# EasyEDA Pro project AM-02驱动板.eprj

# Schematic Schematic1
Create Date: 2023-12-01; Page Name: P1; Project Name: AM-02驱动板; Schematic Name: Schematic1; Update Date: 2023-12-22; Company: 嘉立创EDA; Page Size: A4; Version: V1.0
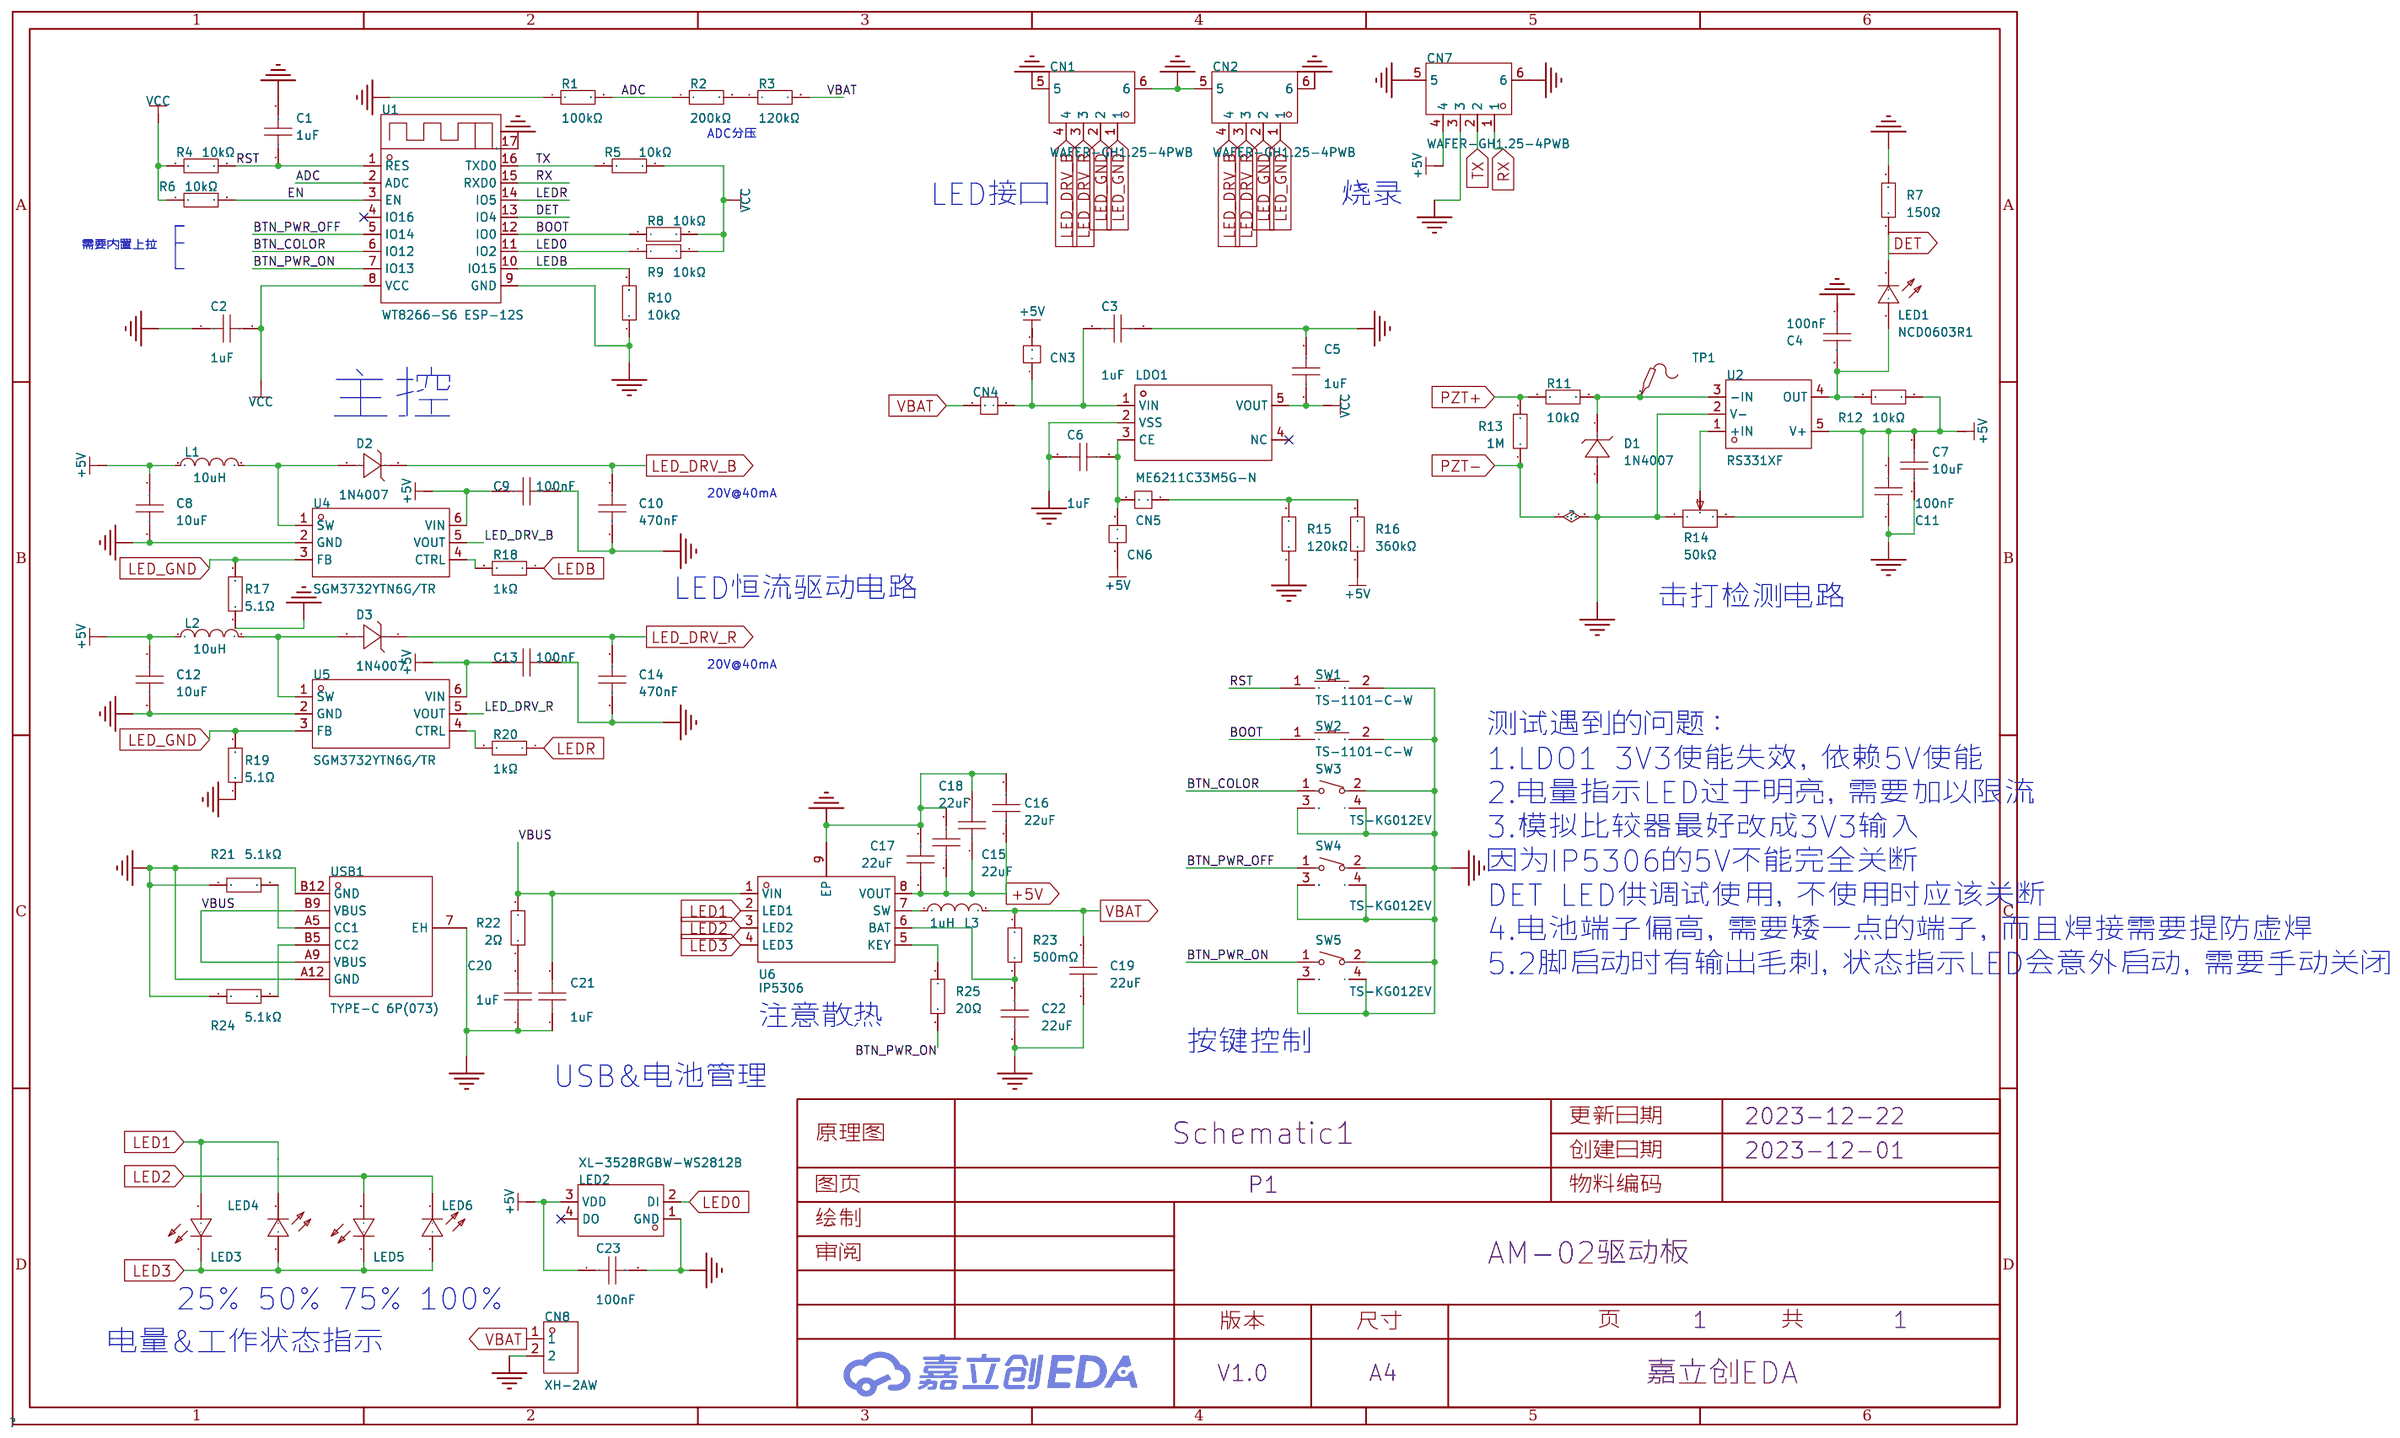
[diagram p0: schematic sheet]

## Parts
C1  1uF  [C0603]
C2  1uF  [C0603]
C3  1uF  [C0603]
C4  100nF  [C0603]
C5  1uF  [C0603]
C6  1uF  [C0603]
C7  10uF  [C0603]
C8  10uF  [C0603]
C9  100nF  [C0603]
C10  470nF  [C0603]
C11  100nF  [C0603]
C12  10uF  [C0603]
C13  100nF  [C0603]
C14  470nF  [C0603]
C15  22uF  [C0603]
C16  22uF  [C0603]
C17  22uF  [C0603]
C18  22uF  [C0603]
C19  22uF  [C0603]
C20  1uF  [C0603]
C21  1uF  [C0603]
C22  22uF  [C0603]
C23  100nF  [C0603]
CN1  WAFER-GH1.25-4PWB  [CONN-SMD_4P-P1.25_XUNPU_WAFER-GH1.25-4PWB]
CN2  WAFER-GH1.25-4PWB  [CONN-SMD_4P-P1.25_XUNPU_WAFER-GH1.25-4PWB]
CN3  -  [cs]
CN4  -  [cs]
CN5  -  [cs]
CN6  -  [cs]
CN7  WAFER-GH1.25-4PWB  [CONN-SMD_4P-P1.25_XUNPU_WAFER-GH1.25-4PWB]
CN8  XH-2AW  [CONN-TH_XH-2AW_C2908611]
D1  1N4007  [SOD-123FL_L2.7-W1.8-LS3.8-RD]
D2  1N4007  [SOD-123FL_L2.7-W1.8-LS3.8-RD]
D3  1N4007  [SOD-123FL_L2.7-W1.8-LS3.8-RD]
L1  10uH  [IND-SMD_L7.3-W6.8]
L2  10uH  [IND-SMD_L7.3-W6.8]
L3  1uH  [IND-SMD_L7.2-W6.6_GPSR0730]
LDO1  ME6211C33M5G-N  [SOT-23-5_L3.0-W1.7-P0.95-LS2.8-BL]
LED1  NCD0603R1  [LED0603-RD_RED]
LED2  XL-3528RGBW-WS2812B  [LED-SMD_4P-L3.5-W2.8-BR-1]
LED3  NCD0603W1  [LED0603-RD]
LED4  NCD0603W1  [LED0603-RD]
LED5  NCD0603W1  [LED0603-RD]
LED6  NCD0603W1  [LED0603-RD]
R1  100kΩ  [R0603]
R2  200kΩ  [R0603]
R3  120kΩ  [R0603]
R4  10kΩ  [R0603]
R5  10kΩ  [R0603]
R6  10kΩ  [R0603]
R7  150Ω  [R0603]
R8  10kΩ  [R0603]
R9  10kΩ  [R0603]
R10  10kΩ  [R0603]
R11  10kΩ  [R0603]
R12  10kΩ  [R0603]
R13  1M  [R0603]
R14  50kΩ  [RES-ADJ-SMD_VG039NCH]
R15  120kΩ  [R0603]
R16  360kΩ  [R0603]
R17  5.1Ω  [R0603]
R18  1kΩ  [R0603]
R19  5.1Ω  [R0603]
R20  1kΩ  [R0603]
R21  5.1kΩ  [R0603]
R22  2Ω  [R0603]
R23  500mΩ  [R0603]
R24  5.1kΩ  [R0603]
R25  20Ω  [R0603]
SW1  TS-1101-C-W  [SW-SMD_L6.0-W3.3-LS8.0]
SW2  TS-1101-C-W  [SW-SMD_L6.0-W3.3-LS8.0]
SW3  TS-KG012EV  [SW-SMD_TS-KG012EV]
SW4  TS-KG012EV  [SW-SMD_TS-KG012EV]
SW5  TS-KG012EV  [SW-SMD_TS-KG012EV]
TP1  -  [Test-Point-0.5mm]
U1  WT8266-S6 ESP-12S  [WIFIM-SMD_16P-L24.0-W16.0-P2.00]
U2  RS331XF  [TSOT-23-5_L2.9-W1.6-P0.95-LS2.8-BR]
U4  SGM3732YTN6G/TR  [TSOT-23-6_L2.9-W1.6-P0.95-LS2.8-BR]
U5  SGM3732YTN6G/TR  [TSOT-23-6_L2.9-W1.6-P0.95-LS2.8-BR]
U6  IP5306  [ESOP-8_L4.9-W3.9-P1.27-LS6.0-BL-EP]
USB1  TYPE-C 6P(073)  [TYPE-C-SMD_TYPE-C-6P]

## Library data of the parts
C1-C3 C5 C6 C20 C21 = CL10A105KB8NNNC: 容值:1uF;精度:±10%;额定电压:50V;材质(温度系数):X5R;; LCSC Part Name: 1uF ±10% 50V; Supplier Part: C15849; Manufacturer: SAMSUNG(三星); Supplier Footprint: 0603; JLCPCB Part Class: Basic Part; Datasheet: https://atta.szlcsc.com/upload/public/pdf/source/20160218/1457707763339.pdf; Supplier: LCSC; Tolerance: ±10%; Voltage Rated: 50V; Temperature Coefficient: X5R
C4 C9 C11 C13 C23 = CC0603KRX7R9BB104: 容值:100nF;精度:±10%;额定电压:50V;材质(温度系数):X7R;; LCSC Part Name: 100nF ±10% 50V; Supplier Part: C14663; Manufacturer: YAGEO(国巨); Supplier Footprint: 0603; JLCPCB Part Class: Basic Part; Datasheet: https://atta.szlcsc.com/upload/public/pdf/source/20180910/C282072_33301C7F631E79921B82A8DAC6BCC5B3.pdf; Supplier: LCSC; Tolerance: ±10%; Voltage Rated: 50V; Temperature Coefficient: X7R
C7 C8 C12 = CL10A106MA8NRNC: 容值:10uF;精度:±20%;额定电压:25V;材质(温度系数):X5R;; LCSC Part Name: 10uF ±20% 25V; Supplier Part: C96446; Manufacturer: SAMSUNG(三星); Supplier Footprint: 0603; JLCPCB Part Class: Basic Part; Datasheet: https://atta.szlcsc.com/upload/public/pdf/source/20160218/1457707763339.pdf; Supplier: LCSC; Tolerance: ±20%; Voltage Rated: 25V; Temperature Coefficient: X5R
C10 C14 = 0603B474K500NT: 容值:470nF;精度:±10%;额定电压:50V;材质(温度系数):X7R;; LCSC Part Name: 470nF ±10% 50V; Supplier Part: C77572; Manufacturer: FH(风华); Supplier Footprint: 0603; JLCPCB Part Class: Extended Part; Datasheet: https://atta.szlcsc.com/upload/public/pdf/source/20200305/C486355_26A10D38EF8C2A5C37091D0039909270.pdf; Supplier: LCSC; Tolerance: ±10%; Voltage Rated: 50V; Temperature Coefficient: X7R
C15-C19 C22 = CL10A226MQ8NRNC: 容值:22uF;精度:±20%;额定电压:6.3V;材质(温度系数):X5R;; LCSC Part Name: 22uF ±20% 6.3V; Supplier Part: C59461; Manufacturer: SAMSUNG(三星); Supplier Footprint: 0603; JLCPCB Part Class: Basic Part; Datasheet: https://atta.szlcsc.com/upload/public/pdf/source/20160218/1457707763339.pdf; Supplier: LCSC; Tolerance: ±20%; Voltage Rated: 6.3V; Temperature Coefficient: X5R
CN1 CN2 CN7 = WAFER-GH1.25-4PWB: 参考系列:GH;间距:1.25mm;插针结构:1x4P;排数:1;每排PIN数:4;公母:公型插针;安装方式:卧贴;额定电流:1A;工作温度范围:-25℃~+85℃;; LCSC Part Name: GH1.25mm 4P 卧贴带扣 带扣; Supplier Part: C3029379; Manufacturer: XUNPU(讯普); Supplier Footprint: SMD,P=1.25mm; JLCPCB Part Class: 扩展库; Datasheet: https://atta.szlcsc.com/upload/public/pdf/source/20220527/CB8773BFB0913C3B8ABD62CB38BA101A.pdf; Supplier: LCSC; Reference Series: GH; Pitch: 1.25mm; Pins Structure: 1x4P; Number of Rows: 1; Number of PINs Per Row: 4; Gender: 公型插针; Mounting Style: 卧贴; Current Rating (Max): 1A; Operating Temperature Range: -25℃~+85℃
CN3-CN6 = cs: Check: false
CN8 = XH-2AW_C2908611: 插针结构:1x2P;间距:2.54mm;公母:公;安装方式:弯插;行距:-;排数:1;每排PIN数:2;参考系列:XH;额定电流:3A;工作温度范围:-25℃~+85℃;; LCSC Part Name: 1x2P 间距:2.54mm 弯插 系列:XH; Supplier Part: C2908611; Manufacturer: HCTL(华灿天禄); Supplier Footprint: 弯插,P=2.54mm; JLCPCB Part Class: 扩展库; Datasheet: https://atta.szlcsc.com/upload/public/pdf/source/20230711/B565BAF3B11666EF6B81B3605408F2BD.pdf; Supplier: LCSC; Pins Structure: 1x2P; Pitch: 2.54mm; Gender: 公; Mounting Style: 弯插; Number of Rows: 1; Number of PINs Per Row: 2; Reference Series: XH; Current Rating (Max): 3A; Operating Temperature Range: -25℃~+85℃
D1-D3 = 1N4007_C727082: 二极管配置:独立式;正向压降(Vf):1.1V@1A;直流反向耐压(Vr):1kV;平均整流电流(Io):1A;; LCSC Part Name: 电压:1kV 电流:1A; Supplier Part: C727082; Manufacturer: TWGMC(台湾迪嘉); Supplier Footprint: SOD-123FL; JLCPCB Part Class: 扩展库; Datasheet: https://atta.szlcsc.com/upload/public/pdf/source/20200828/C727082_2F914037E829F0E2238583225D7ED281.pdf; Supplier: LCSC; Diode Configuration: 独立式; Forward Voltage (Vf@If): 1.1V@1A; Reverse Voltage (Vr): 1kV; Average Rectified Current (Io): 1A; Reverse Leakage Current: 10uA@1kV
L1 L2 = FXL0630-100-M: 电感值:10uH;精度:±20%;额定电流:4.5A;类型:一体成型电感;饱和电流(Isat):5.5A;; LCSC Part Name: 10uH ±20% 5.5A; Supplier Part: C167223; Manufacturer: cjiang(长江微电); Supplier Footprint: SMD,6.6x7mm; JLCPCB Part Class: 扩展库; Datasheet: https://atta.szlcsc.com/upload/public/pdf/source/20230516/3A080F5AF8C87BB81C3BA86E5F60E51A.pdf; Supplier: LCSC; Tolerance: ±20%; Rated Current: 4.5A; Type: 一体成型电感; DC Resistance (DCR): 68mΩ; Saturation Current (Isat): 5.5A
L3 = CYA0630-1.0UH: 电感值:1uH;精度:±20%;额定电流:12A;直流电阻(DCR):7mΩ;; LCSC Part Name: 1uH ±20%; Supplier Part: C5189744; Manufacturer: SHOU HAN(首韩); Supplier Footprint: SMD,6.6x7.2mm; JLCPCB Part Class: 扩展库; Datasheet: https://atta.szlcsc.com/upload/public/pdf/source/20221010/BB361918FC2293A10D07F0460E6D4CEC.pdf; Supplier: LCSC; Tolerance: ±20%; Rated Current: 12A; DC Resistance (DCR): 7mΩ
LDO1 = ME6211C33M5G-N: 输出类型:固定;输出极性:正;最大输入电压:6V;输出电压:3.3V;输出电流:500mA;电源纹波抑制比(PSRR):70dB;; Supplier Part: C82942; Manufacturer: MICRONE(南京微盟); Supplier Footprint: SOT-23-5; JLCPCB Part Class: 扩展库; Datasheet: https://atta.szlcsc.com/upload/public/pdf/source/20170918/C82942_1505727073070976520.pdf; Supplier: LCSC; Output Type: 固定; Output Polarity: 正; Number of Outputs: 1; Maximum Input Voltage: 6V; Output Voltage: 3.3V; Dropout Voltage: 260mV@(200mA); Output Current: 500mA; Power Supply Rejection Ratio (PSRR): 70dB
LED1 = NCD0603R1_C84263: 发光颜色:红色;功率:65mW;透镜颜色:无色透明;主波长:615nm~630nm;发光强度:80mcd~220mcd;发光角度:130°;工作温度:-30℃~+85℃;; LCSC Part Name: 红灯 0603红灯   正贴; Supplier Part: C84263; Manufacturer: 国星光电; Supplier Footprint: 0603; JLCPCB Part Class: Extended Part; Datasheet: https://atta.szlcsc.com/upload/public/pdf/source/20200820/C84263_DABC6A75E58F576973B407FDBA283D60.pdf; Supplier: LCSC; Emitted Color: 红色; Forward Voltage (VF): 1.6V~2.6V; Forward Current: 20mA; Power Dissipation: 65mW; Lens Color: 无色透明; Dominant Wavelength: 615nm~630nm; Luminous Intensity: 80mcd~220mcd; Viewing Angle: 130°; Operating Temperature: -30℃~+85℃
LED2 = XL-3528RGBW-WS2812B: 发光颜色:RGB三色;二极管配置:-;功率:50mW；50mW；45mW;主波长:618nm~623nm；520nm~525nm；467nm~472nm;发光角度:120°;安装方式:正贴;工作温度:-25℃~+80℃;; LCSC Part Name: RGB三色 正贴 幻彩; Supplier Part: C2890364; Manufacturer: XINGLIGHT(成兴光); Supplier Footprint: SMD3528-4P; JLCPCB Part Class: 扩展库; Datasheet: https://atta.szlcsc.com/upload/public/pdf/source/20230707/D057C4FFF40CAC379BBCAAC4763A2431.pdf; Supplier: LCSC; Emitted Color: RGB三色; Forward Current: 20mA; Power Dissipation: 50mW；50mW；45mW; Dominant Wavelength: 618nm~623nm；520nm~525nm；467nm~472nm; Peak Wavelength: 525nm；623nm；472nm; Viewing Angle: 120°; Mounting Sytle: 正贴; Operating Temperature: -25℃~+80℃
LED3-LED6 = NCD0603W1: 发光颜色:白色;功率:72mW;透镜颜色:雾状黄;发光强度:200mcd~300mcd;发光角度:130°;工作温度:-30℃~+85℃;; LCSC Part Name: 白灯 0603白灯   正贴; Supplier Part: C84265; Manufacturer: 国星光电; Supplier Footprint: 0603; JLCPCB Part Class: 扩展库; Datasheet: https://atta.szlcsc.com/upload/public/pdf/source/20200820/C84265_479E6193713348A548E5CD6D9278BF16.pdf; Supplier: LCSC; Emitted Color: 白色; Forward Voltage (VF): 2.6V~3.6V; Forward Current: 5mA; Power Dissipation: 72mW; Lens Color: 雾状黄; Luminous Intensity: 200mcd~300mcd; Viewing Angle: 130°; Operating Temperature: -30℃~+85℃
R1 = 0603WAF1003T5E: 阻值:100kΩ;精度:±1%;功率:100mW;温度系数:±100ppm/℃;电阻类型:厚膜电阻;; LCSC Part Name: 100kΩ ±1% 100mW 厚膜电阻; Supplier Part: C25803; Manufacturer: UNI-ROYAL(厚声); Supplier Footprint: 0603; JLCPCB Part Class: Basic Part; Datasheet: https://atta.szlcsc.com/upload/public/pdf/source/20200306/C422600_1E6D84923E4A46A82E41ADD87F860B5C.pdf; Supplier: LCSC; Type: 厚膜电阻; Tolerance: ±1%; Power(Watts): 100mW; Temperature Coefficient: ±100ppm/℃; Overload Voltage (Max): 75V; Operating Temperature Range: -55℃~+155℃
R2 = 0603WAF2003T5E: 阻值:200kΩ;精度:±1%;功率:100mW;温度系数:±100ppm/℃;电阻类型:厚膜电阻;; LCSC Part Name: 200kΩ ±1% 100mW 厚膜电阻; Supplier Part: C25811; Manufacturer: UNI-ROYAL(厚声); Supplier Footprint: 0603; JLCPCB Part Class: 基础库; Datasheet: https://atta.szlcsc.com/upload/public/pdf/source/20200306/C422600_1E6D84923E4A46A82E41ADD87F860B5C.pdf; Supplier: LCSC; Tolerance: ±1%; Power(Watts): 100mW; Overload Voltage (Max): 75V; Temperature Coefficient: ±100ppm/℃; Type: 厚膜电阻; Operating Temperature Range: -55℃~+155℃
R3 R15 = 0603WAF1203T5E: 阻值:120kΩ;精度:±1%;功率:100mW;温度系数:±100ppm/℃;电阻类型:厚膜电阻;; LCSC Part Name: 120kΩ ±1% 100mW 厚膜电阻; Supplier Part: C25808; Manufacturer: UNI-ROYAL(厚声); Supplier Footprint: 0603; JLCPCB Part Class: Basic Part; Datasheet: https://atta.szlcsc.com/upload/public/pdf/source/20200306/C422600_1E6D84923E4A46A82E41ADD87F860B5C.pdf; Supplier: LCSC; Tolerance: ±1%; Power(Watts): 100mW; Overload Voltage (Max): 75V; Temperature Coefficient: ±100ppm/℃; Type: 厚膜电阻; Operating Temperature Range: -55℃~+155℃
R4-R6 R8-R10 R12 = 0603WAF1002T5E: 电阻类型:厚膜电阻;阻值:10kΩ;精度:±1%;功率:100mW;; LCSC Part Name: 厚膜电阻 10kΩ ±1% 100mW; Supplier Part: C25804; Manufacturer: UNI-ROYAL(厚声); Supplier Footprint: 0603; JLCPCB Part Class: Basic Part; Datasheet: https://atta.szlcsc.com/upload/public/pdf/source/20200306/C422600_1E6D84923E4A46A82E41ADD87F860B5C.pdf; Supplier: LCSC; Type: 厚膜电阻; Tolerance: ±1%; Power(Watts): 100mW; Temperature Coefficient: ±100ppm/℃; Overload Voltage (Max): 75V; Operating Temperature Range: -55℃~+155℃
R7 = 0603WAF1500T5E: 阻值:150Ω;精度:±1%;功率:100mW;温度系数:±100ppm/℃;电阻类型:厚膜电阻;; LCSC Part Name: 150Ω ±1% 100mW 厚膜电阻; Supplier Part: C22808; Manufacturer: UNI-ROYAL(厚声); Supplier Footprint: 0603; JLCPCB Part Class: Basic Part; Datasheet: https://atta.szlcsc.com/upload/public/pdf/source/20200306/C422600_1E6D84923E4A46A82E41ADD87F860B5C.pdf; Supplier: LCSC; Tolerance: ±1%; Power(Watts): 100mW; Overload Voltage (Max): 75V; Temperature Coefficient: ±100ppm/℃; Type: 厚膜电阻; Operating Temperature Range: -55℃~+155℃
R11 = 0603WAF1002T5E: 阻值:10kΩ;精度:±1%;功率:100mW;温度系数:±100ppm/℃;电阻类型:厚膜电阻;; LCSC Part Name: 10kΩ ±1% 100mW 厚膜电阻; Supplier Part: C25804; Manufacturer: UNI-ROYAL(厚声); Supplier Footprint: 0603; JLCPCB Part Class: Basic Part; Datasheet: https://atta.szlcsc.com/upload/public/pdf/source/20200306/C422600_1E6D84923E4A46A82E41ADD87F860B5C.pdf; Supplier: LCSC; Type: 厚膜电阻; Tolerance: ±1%; Power(Watts): 100mW; Temperature Coefficient: ±100ppm/℃; Overload Voltage (Max): 75V; Operating Temperature Range: -55℃~+155℃
R13 = Res_0603: Supplier Footprint: 0603
R14 = VG039NCHXTB503: 阻值:50kΩ;精度:±25%;功率:150mW;; Supplier Part: C145161; Manufacturer: HDK(北陆电气); Supplier Footprint: SMD; JLCPCB Part Class: 扩展库; Datasheet: https://atta.szlcsc.com/upload/public/pdf/source/20171123/C145161_15114111011641137837.pdf; Supplier: LCSC; Tolerance: ±25%; Power(Watts): 150mW; Turns: 1
R16 = RTT033603FTP: 电阻类型:厚膜电阻;阻值:360kΩ;精度:±1%;功率:100mW;; LCSC Part Name: 360kΩ ±1% 100mW; Supplier Part: C103574; Manufacturer: RALEC(旺诠); Supplier Footprint: 0603; JLCPCB Part Class: Extended Part; Datasheet: https://atta.szlcsc.com/upload/public/pdf/source/20170408/1491642923357.pdf; Supplier: LCSC; Type: 厚膜电阻; Tolerance: ±1%; Power(Watts): 100mW; Temperature Coefficient: ±100ppm/℃; Overload Voltage (Max): 75V; Operating Temperature Range: -55℃~+155℃
R17 R19 = 0603WAF510KT5E: 阻值:5.1Ω;精度:±1%;功率:100mW;温度系数:±200ppm/℃;电阻类型:厚膜电阻;; LCSC Part Name: 5.1Ω ±1% 100mW 厚膜电阻; Supplier Part: C25197; Manufacturer: UNI-ROYAL(厚声); Supplier Footprint: 0603; JLCPCB Part Class: Basic Part; Datasheet: https://atta.szlcsc.com/upload/public/pdf/source/20200306/C422600_1E6D84923E4A46A82E41ADD87F860B5C.pdf; Supplier: LCSC; Tolerance: ±1%; Power(Watts): 100mW; Overload Voltage (Max): 75V; Temperature Coefficient: ±200ppm/℃; Type: 厚膜电阻; Operating Temperature Range: -55℃~+155℃
R18 R20 = 0603WAF1001T5E: 阻值:1kΩ;精度:±1%;功率:100mW;温度系数:±100ppm/℃;电阻类型:厚膜电阻;; LCSC Part Name: 1kΩ ±1% 100mW 厚膜电阻; Supplier Part: C21190; Manufacturer: UNI-ROYAL(厚声); Supplier Footprint: 0603; JLCPCB Part Class: Basic Part; Datasheet: https://atta.szlcsc.com/upload/public/pdf/source/20200306/C422600_1E6D84923E4A46A82E41ADD87F860B5C.pdf; Supplier: LCSC; Tolerance: ±1%; Power(Watts): 100mW; Overload Voltage (Max): 75V; Temperature Coefficient: ±100ppm/℃; Type: 厚膜电阻; Operating Temperature Range: -55℃~+155℃
R21 R24 = 0603WAF5101T5E: 电阻类型:厚膜电阻;阻值:5.1kΩ;精度:±1%;功率:100mW;; LCSC Part Name: 5.1kΩ ±1% 100mW; Supplier Part: C23186; Manufacturer: UNI-ROYAL(厚声); Supplier Footprint: 0603; JLCPCB Part Class: Basic Part; Datasheet: https://atta.szlcsc.com/upload/public/pdf/source/20200306/C422600_1E6D84923E4A46A82E41ADD87F860B5C.pdf; Supplier: LCSC; Type: 厚膜电阻; Tolerance: ±1%; Power(Watts): 100mW; Temperature Coefficient: ±100ppm/℃; Overload Voltage (Max): 75V; Operating Temperature Range: -55℃~+155℃
R22 = 0603WAF200KT5E: 阻值:2Ω;精度:±1%;功率:100mW;温度系数:±200ppm/℃;电阻类型:厚膜电阻;; LCSC Part Name: 2Ω ±1% 100mW 厚膜电阻; Supplier Part: C22977; Manufacturer: UNI-ROYAL(厚声); Supplier Footprint: 0603; JLCPCB Part Class: Basic Part; Datasheet: https://atta.szlcsc.com/upload/public/pdf/source/20200306/C422600_1E6D84923E4A46A82E41ADD87F860B5C.pdf; Supplier: LCSC; Tolerance: ±1%; Power(Watts): 100mW; Overload Voltage (Max): 75V; Temperature Coefficient: ±200ppm/℃; Type: 厚膜电阻; Operating Temperature Range: -55℃~+155℃
R23 = CR0603FR500P05Z: 电阻类型:厚膜电阻;阻值:500mΩ;功率:100mW;精度:±1%;; LCSC Part Name: 厚膜电阻 500mΩ ±1% 100mW; Supplier Part: C149624; Manufacturer: EVER OHMS(天二科技); Supplier Footprint: 0603; JLCPCB Part Class: Extended Part; Datasheet: https://atta.szlcsc.com/upload/public/pdf/source/20190724/C171430_9E147A274D2811BD276FBB11C8CE6534.pdf; Supplier: LCSC; Type: 厚膜电阻; Power(Watts): 100mW; Overload Voltage (Max): 50V; Tolerance: ±1%; Operating Temperature Range: -55℃~+155℃
R25 = 0603WAF200JT5E: 阻值:20Ω;精度:±1%;功率:100mW;温度系数:±100ppm/℃;电阻类型:厚膜电阻;; LCSC Part Name: 20Ω ±1% 100mW 厚膜电阻; Supplier Part: C22950; Manufacturer: UNI-ROYAL(厚声); Supplier Footprint: 0603; JLCPCB Part Class: Basic Part; Datasheet: https://atta.szlcsc.com/upload/public/pdf/source/20200306/C422600_1E6D84923E4A46A82E41ADD87F860B5C.pdf; Supplier: LCSC; Tolerance: ±1%; Power(Watts): 100mW; Overload Voltage (Max): 75V; Temperature Coefficient: ±100ppm/℃; Type: 厚膜电阻; Operating Temperature Range: -55℃~+155℃
SW1 SW2 = TS-1101-C-W: 触点电流:50mA;额定电压(AC):-;额定电压(DC):12V;额定功率:-;绝缘电阻:-;电路结构:单刀单掷;安装方式:立贴;带灯:无;作用力:260gf;机械寿命:5万次;带支架:否;; LCSC Part Name: 立贴 6*3.6*2.5mm 轻触开关 一型3*6*2.5有白ZD b拉伸白色带淡绿按键 卷装; Supplier Part: C318938; Manufacturer: XKB Connectivity(中国星坤); Supplier Footprint: SMD; JLCPCB Part Class: 扩展库; Datasheet: https://atta.szlcsc.com/upload/public/pdf/source/20200227/C318938_C2E53B1EEDE37D980A33616AC086DE53.pdf; Supplier: LCSC; Contact Current: 50mA; Voltage Rating (DC): 12V; Circuit: 单刀单掷; Mounting Style: 立贴; Actuator Style: 矩形按钮; Actuator/Cap Color: 白色带淡绿; With Lamp: 无; Operating Force: 260gf; Mechanical Life: 5万次; Operating Temperature: -30℃~+85℃; Switch Length: 6mm; Switch Width: 3.6mm; Switch Height: 2.5mm; Strike Gundam: 否
SW3-SW5 = TS-KG012EV: 触点电流:50mA;额定电压(DC):12V;绝缘电阻:100MΩ;电路结构:单刀单掷;安装方式:卧插;按钮形状:矩形按钮;带灯:-;; LCSC Part Name: 轻触开关3*6*3.5侧按卧式 带柱; Supplier Part: C410363; Manufacturer: HANBO(汉博); Supplier Footprint: 插件,3.6x7.8mm; JLCPCB Part Class: Extended Part; Datasheet: https://atta.szlcsc.com/upload/public/pdf/source/20221110/2C1BC81D53AC7E4C4CC26C5BC87C8C3B.pdf; Supplier: LCSC; Contact Current: 50mA; Voltage Rating (DC): 12V; Insulation Resistance: 100MΩ; Circuit: 单刀单掷; Mounting Style: 卧插; Actuator Style: 矩形按钮
TP1 = Test-Point: Test Point 测试点
U1 = WT8266-S6 ESP-12S: WT8266-S6是ESP8266核载PCB天线wifi模组，32位型MCU超低功耗高性价比的嵌入式无线网络控制模块，主频支持80MHz和160MHz,支持RTOS,集成wi-Fi MAC/BB/RF/PA/LNA,外接弹簧天线，支持标准IEEE802.11b/g/n协议，完整的TCP/IP协议栈，可满足智能电网，楼宇自动化，安防，智能家居，远程医疗等物联网应用需求。; Supplier Part: C477830; Manufacturer: Wireless-tag(启明云端); Supplier Footprint: SMD,16x24mm; JLCPCB Part Class: 扩展库; Datasheet: https://atta.szlcsc.com/upload/public/pdf/source/20200102/C477830_0ECDB2D8EA191782048DC96C9617E80C.pdf; Supplier: LCSC
U2 = RS331XF: 1.8~5.5V的通用低压开漏输出比较器RS331/393/339，电源电流50μA; LCSC Part Name: 模拟比较器; Supplier Part: C783423; Manufacturer: RUNIC(润石); Supplier Footprint: SOT-23-5; JLCPCB Part Class: 扩展库; Datasheet: https://atta.szlcsc.com/upload/public/pdf/source/20200914/C783423_7BDF8E1CA49CF20643CF92C6F97443B2.pdf; Supplier: LCSC
U4 U5 = SGM3732YTN6G/TR: Supplier Part: C116578; Manufacturer: SGMICRO(圣邦微); Supplier Footprint: TSOT-23-6; JLCPCB Part Class: 扩展库; Datasheet: https://atta.szlcsc.com/upload/public/pdf/source/20170705/1499242732366.pdf; Supplier: LCSC
U6 = IP5306: 2.1A充电2.4A放电高集成度移动电源SOC; Supplier Part: C181692; Manufacturer: INJOINIC(英集芯); Supplier Footprint: SOP-8-EP; JLCPCB Part Class: 扩展库; Datasheet: https://atta.szlcsc.com/upload/public/pdf/source/20190627/C384572_9925B3DDC4041BC6108E5AB46A2A0AB1.pdf; Supplier: LCSC
USB1 = TYPE-C 6P(073): 连接器类型:Type-C;标准:-;公母:母;触点数量:6P;端口数量:1;安装方式:卧贴;额定电流 - 电源:5A;工作温度范围:-25℃~+85℃;; LCSC Part Name: Type-C 母 卧贴; Supplier Part: C668623; Manufacturer: SHOU HAN(首韩); Supplier Footprint: SMD; JLCPCB Part Class: 扩展库; Datasheet: https://atta.szlcsc.com/upload/public/pdf/source/20200618/C668623_A4B260DED7AC1949BAC6AE39E9F4CD80.pdf; Supplier: LCSC; Connector Type: Type-C; Gender: 母; Number of Contacts: 6P; Number of Ports: 1; Mounting Style: 卧贴; Current Rating - Power (Max): 5A; Operating Temperature Range: -25℃~+85℃

## Nets
+5V: C7.1 C8.1 C9.2 C11.1 C12.1 C13.2 C15.1 C16.1 C17.1 C18.1 C23.1 CN3.2 CN6.1 CN7.4 L1.1 L2.1 LED2.3(VDD) R12.1 R14.3 R16.1 U2.5(V+) U4.6(VIN) U5.6(VIN) U6.8(VOUT)
GND: C1.2 C2.1 C3.2 C4.1 C5.2 C6.2 C7.2 C8.2 C9.1 C10.2 C11.2 C12.2 C13.1 C14.2 C15.2 C16.2 C17.2 C18.2 C19.1 C20.1 C21.1 C22.1 C23.2 CN1.5 CN1.6 CN2.5 CN2.6 CN7.3 CN7.5 CN7.6 CN8.2 D1.2(A) LDO1.2(VSS) LED2.1(GND) R1.1 R7.2 R10.1 R13.1 R14.1 R15.1 R17.1 R19.1 R21.1 R24.1 SW1.2 SW2.2 SW3.2 SW3.3 SW3.4 SW4.2 SW4.3 SW4.4 SW5.2 SW5.3 SW5.4 U1.9(GND) U1.17(PAD) U2.2(V-) U4.2(GND) U5.2(GND) U6.9(EP) USB1.7(EH) USB1.A12(GND) USB1.B12(GND)
VBAT: C19.2 CN4.2 CN8.1 L3.2 R3.2 R23.1
VBUS: C21.2 R22.2 U6.1(VIN) USB1.A9(VBUS) USB1.B9(VBUS)
VCC: C2.2 C5.1 LDO1.5(VOUT) R4.1 R5.2 R6.1 R8.2 R9.2 U1.8(VCC)
ADC: R1.2 R2.1 U1.2(ADC)
BOOT: R8.1 SW2.1 U1.12(IO0)
BTN_COLOR: SW3.1 U1.6(IO12)
BTN_PWR_OFF: SW4.1 U1.5(IO14)
BTN_PWR_ON: R25.2 SW5.1 U1.7(IO13)
DET: LED1.1(K) R7.1 U1.13(IO4)
EN: R6.2 U1.3(EN)
LED0: LED2.2(DI) R9.1 U1.11(IO2)
LED1: LED3.2(+) LED4.1(-) U6.2(LED1)
LED2: LED5.2(+) LED6.1(-) U6.3(LED2)
LED3: LED3.1(-) LED4.2(+) LED5.1(-) LED6.2(+) U6.4(LED3)
LED_DRV_B: C10.1 CN1.4 CN2.4 D2.1(K) U4.5(VOUT)
LED_DRV_R: C14.1 CN1.3 CN2.3 D3.1(K) U5.5(VOUT)
LED_GND: CN1.1 CN1.2 CN2.1 CN2.2 R17.2 R19.2 U4.3(FB) U5.3(FB)
LEDB: R10.2 R18.1 U1.10(IO15)
LEDR: R20.1 U1.14(IO5)
PZT+: R11.2 R13.2
RST: C1.1 R4.2 SW1.1 U1.1(RES)
RX: CN7.1 U1.15(RXD0)
TX: CN7.2 R5.1 U1.16(TXD0)
$1N2901: R21.2 USB1.A5(CC1)
$1N2902: R24.2 USB1.B5(CC2)
$1N3120: C20.2 R22.1
$1N3822: R25.1 U6.5(KEY)
$1N4370: C22.2 R23.2 U6.6(BAT)
$1N4629: L3.1 U6.7(SW)
$1N6430: D2.2(A) L1.2 U4.1(SW)
$1N8583: D3.2(A) L2.2 U5.1(SW)
$1N10986: R2.2 R3.1
$1N13736: R14.2 U2.1(+IN)
$1N13750: D1.1(K) R11.1 TP1.1 U2.3(-IN)
$1N19690: R18.2 U4.4(CTRL)
$1N19718: R20.2 U5.4(CTRL)
Net-(C3-1): C3.1 CN3.1 CN4.1 LDO1.1(VIN)
Net-(C4-2): C4.2 LED1.2(A) R12.2 U2.4(OUT)
Net-(C6-1): C6.1 CN5.2 CN6.2 LDO1.3(CE)
Net-(CN5-1): CN5.1 R15.2 R16.2

Not connected (* = marked no-connect by the designer): LDO1 4(NC)*; LED2 4(DO)*; U1 4(IO16)*

## Notes on the sheet
- ADC分压
- LED接口
- 烧录
- 需要内置上拉
- 主控
- 20V@40mA
- LED恒流驱动电路
- 击打检测电路
- 20V@40mA
- 测试遇到的问题：
  1.LDO1 3V3使能失效，依赖5V使能
  2.电量指示LED过于明亮，需要加以限流
  3.模拟比较器最好改成3V3输入
  因为IP5306的5V不能完全关断
  DET LED供调试使用，不使用时应该关断
  4.电池端子偏高，需要矮一点的端子，而且焊接需要提防虚焊
  5.2脚启动时有输出毛刺，状态指示LED会意外启动，需要手动关闭
- 注意散热
- 按键控制
- USB&电池管理
- 25% 50% 75% 100%
- 电量&工作状态指示

# Schematic Schematic2
Create Date: 2023-12-03; Page Name: P1; Project Name: 自定义装甲板驱动电路; Schematic Name: Schematic2; Update Date: 2023-12-03; Company: 嘉立创EDA; Page Size: A4; Version: V1.0
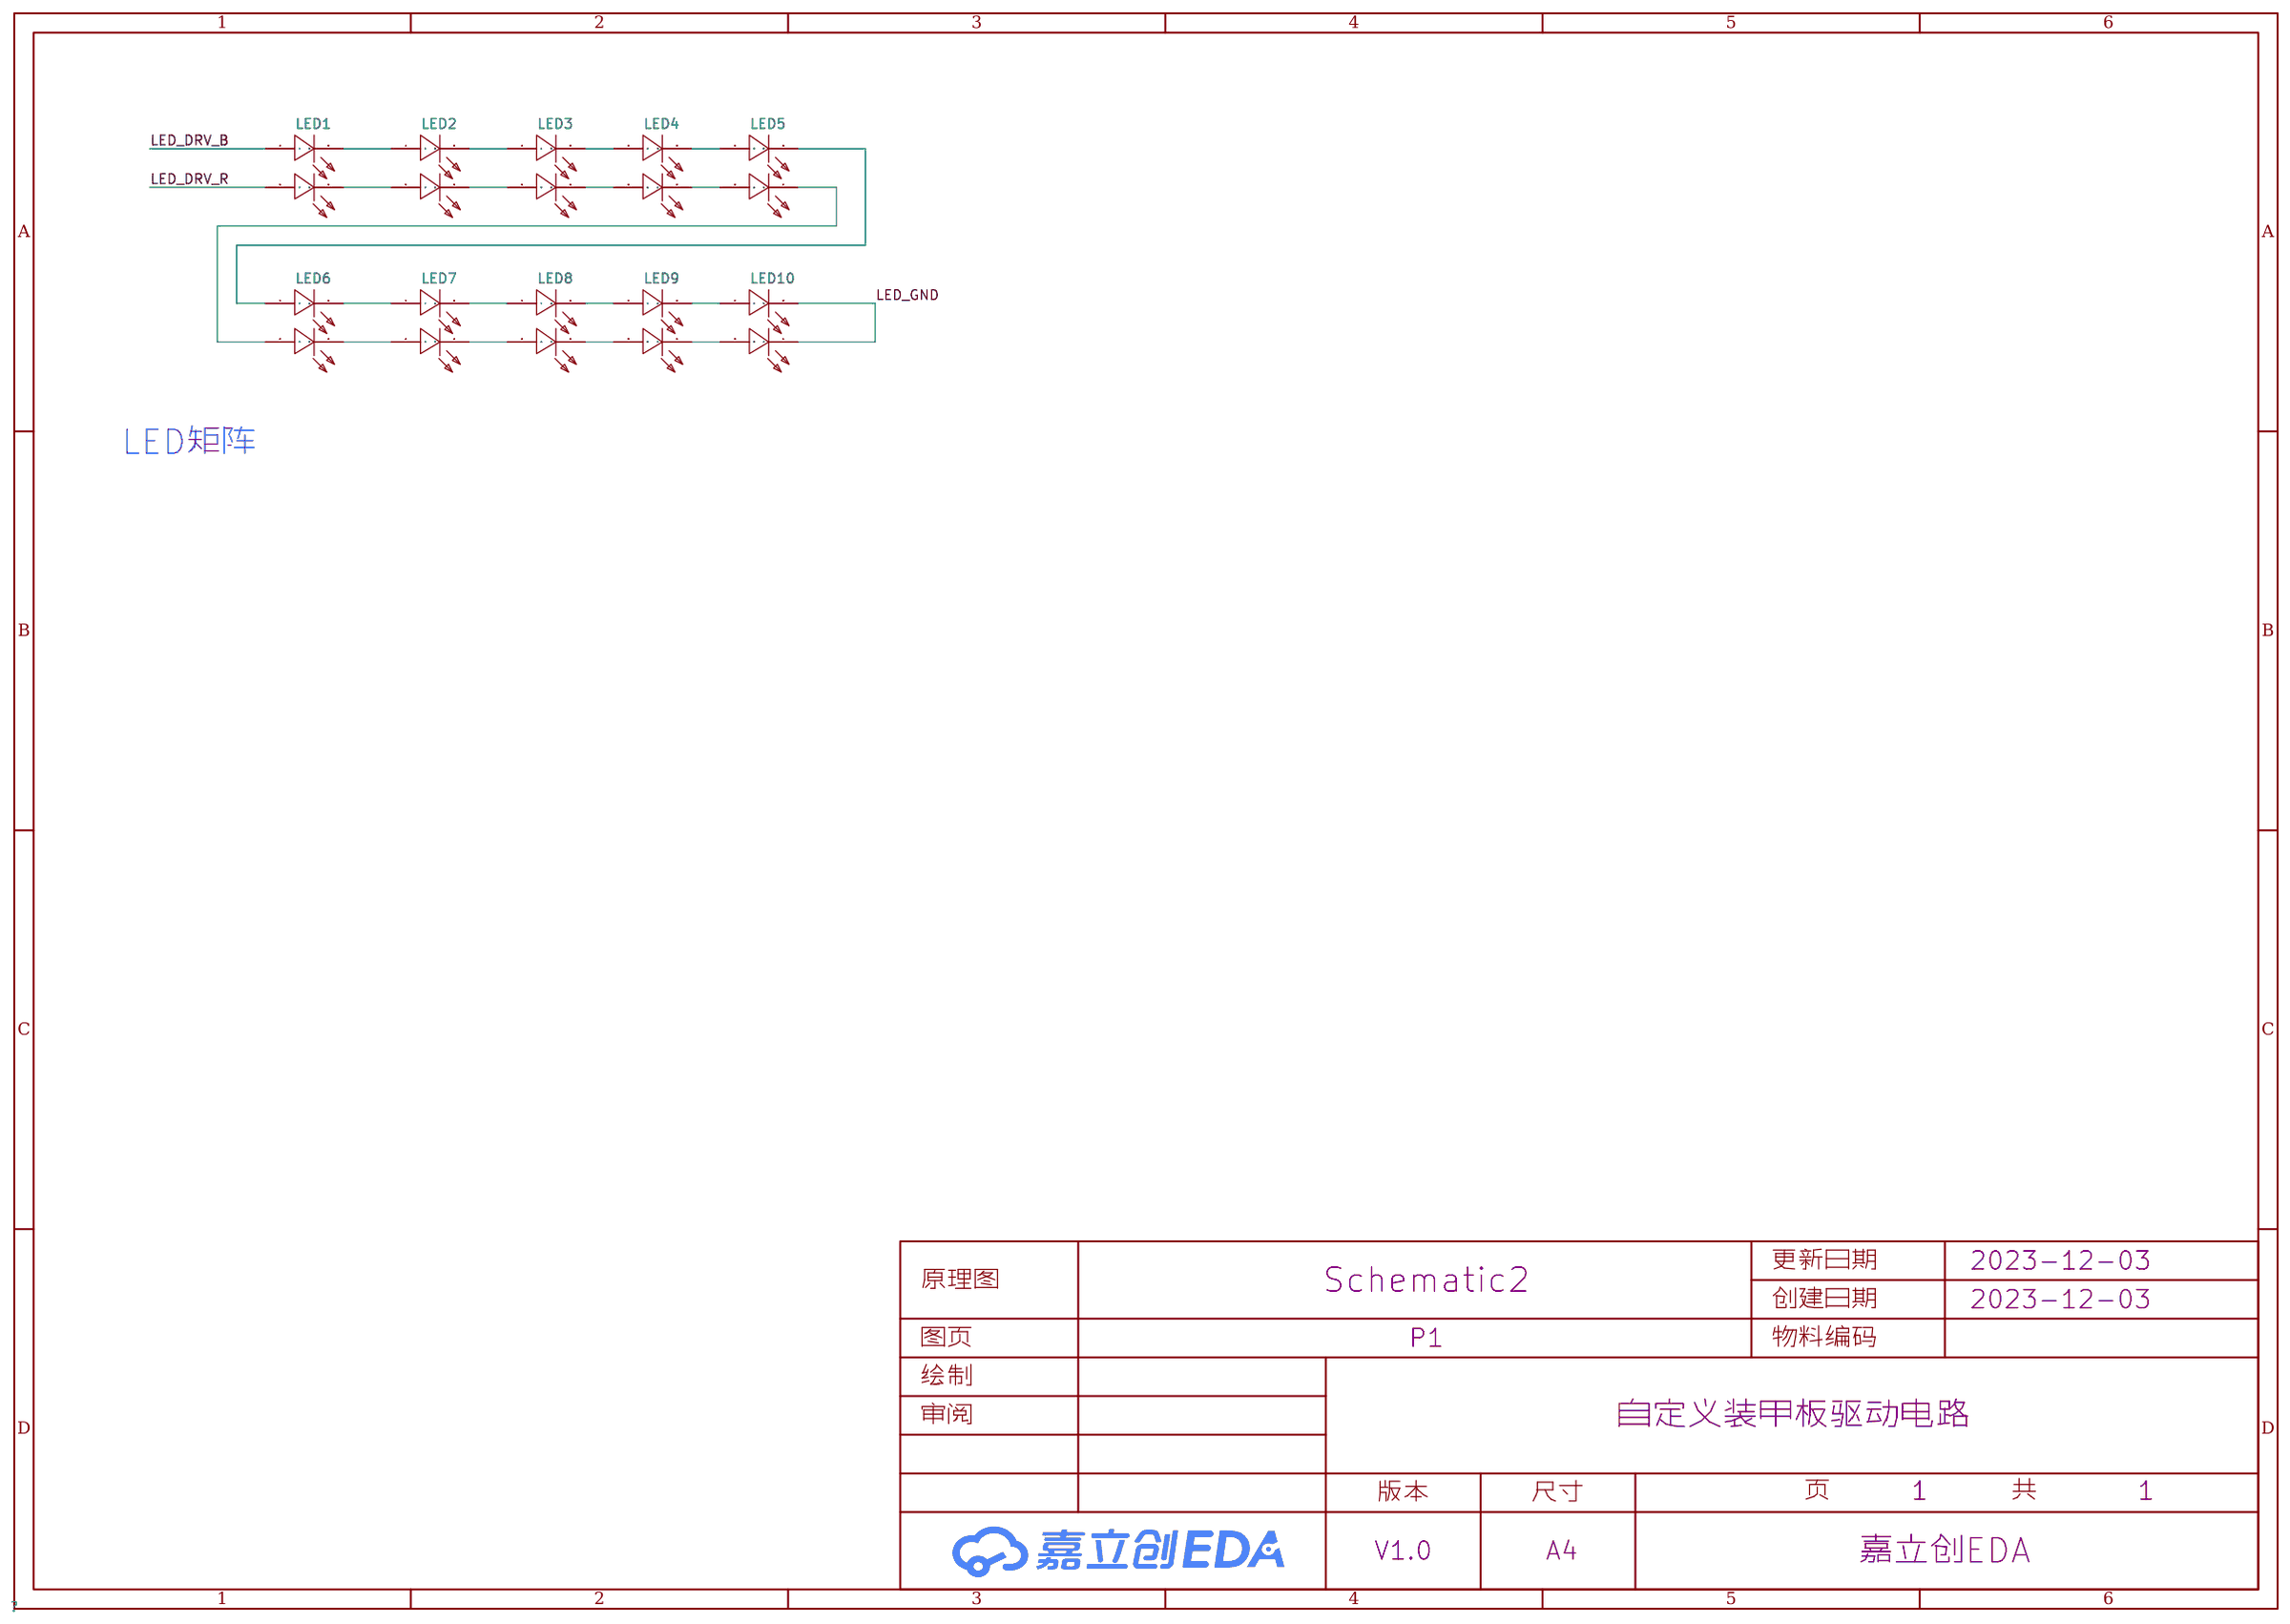
[diagram p1: schematic sheet]

## Parts
LED1  XL-3528SURUBC  [LED-SMD_4P-L3.2-W2.8-LS3.5-TL]
LED2  XL-3528SURUBC  [LED-SMD_4P-L3.2-W2.8-LS3.5-TL]
LED3  XL-3528SURUBC  [LED-SMD_4P-L3.2-W2.8-LS3.5-TL]
LED4  XL-3528SURUBC  [LED-SMD_4P-L3.2-W2.8-LS3.5-TL]
LED5  XL-3528SURUBC  [LED-SMD_4P-L3.2-W2.8-LS3.5-TL]
LED6  XL-3528SURUBC  [LED-SMD_4P-L3.2-W2.8-LS3.5-TL]
LED7  XL-3528SURUBC  [LED-SMD_4P-L3.2-W2.8-LS3.5-TL]
LED8  XL-3528SURUBC  [LED-SMD_4P-L3.2-W2.8-LS3.5-TL]
LED9  XL-3528SURUBC  [LED-SMD_4P-L3.2-W2.8-LS3.5-TL]
LED10  XL-3528SURUBC  [LED-SMD_4P-L3.2-W2.8-LS3.5-TL]

## Library data of the parts
LED1-LED10 = XL-3528SURUBC: 发光颜色:红灯,蓝灯;二极管配置:-;主波长:462.5nm~465nm；620nm~625nm;功率:90mW；90mW;安装方式:正贴;; LCSC Part Name: 正贴 （同极性脚位）; Supplier Part: C2843811; Manufacturer: XINGLIGHT(成兴光); Supplier Footprint: SMD3528; JLCPCB Part Class: 扩展库; Datasheet: https://atta.szlcsc.com/upload/public/pdf/source/20221102/213A0B15308BC841DAD2CFA01F42E005.pdf; Supplier: LCSC; Emitted Color: 红灯,蓝灯; Lens Color: 无色透明; Dominant Wavelength: 462.5nm~465nm；620nm~625nm; Peak Wavelength: 625nm；465nm; Forward Current: 30mA; Power Dissipation: 90mW；90mW; Viewing Angle: 120°; Mounting Sytle: 正贴; Operating Temperature: -30℃~+85℃

## Nets
LED_DRV_B: LED1.4
LED_DRV_R: LED1.2
LED_GND: LED10.1 LED10.3
$1N497: LED2.1 LED3.2
$1N498: LED4.1 LED5.2
$1N499: LED7.1 LED8.2
$1N500: LED9.1 LED10.2
$1N505: LED1.3 LED2.4
$1N506: LED2.3 LED3.4
$1N507: LED4.3 LED5.4
$1N508: LED7.3 LED8.4
$1N509: LED9.3 LED10.4
$1N510: LED5.1 LED6.2
$1N511: LED8.3 LED9.4
$1N512: LED3.3 LED4.4
$1N513: LED8.1 LED9.2
$1N514: LED3.1 LED4.2
$1N515: LED5.3 LED6.4
$1N516: LED6.1 LED7.2
$1N517: LED6.3 LED7.4
$1N518: LED1.1 LED2.2

## Notes on the sheet
- LED矩阵

# Board PCB1
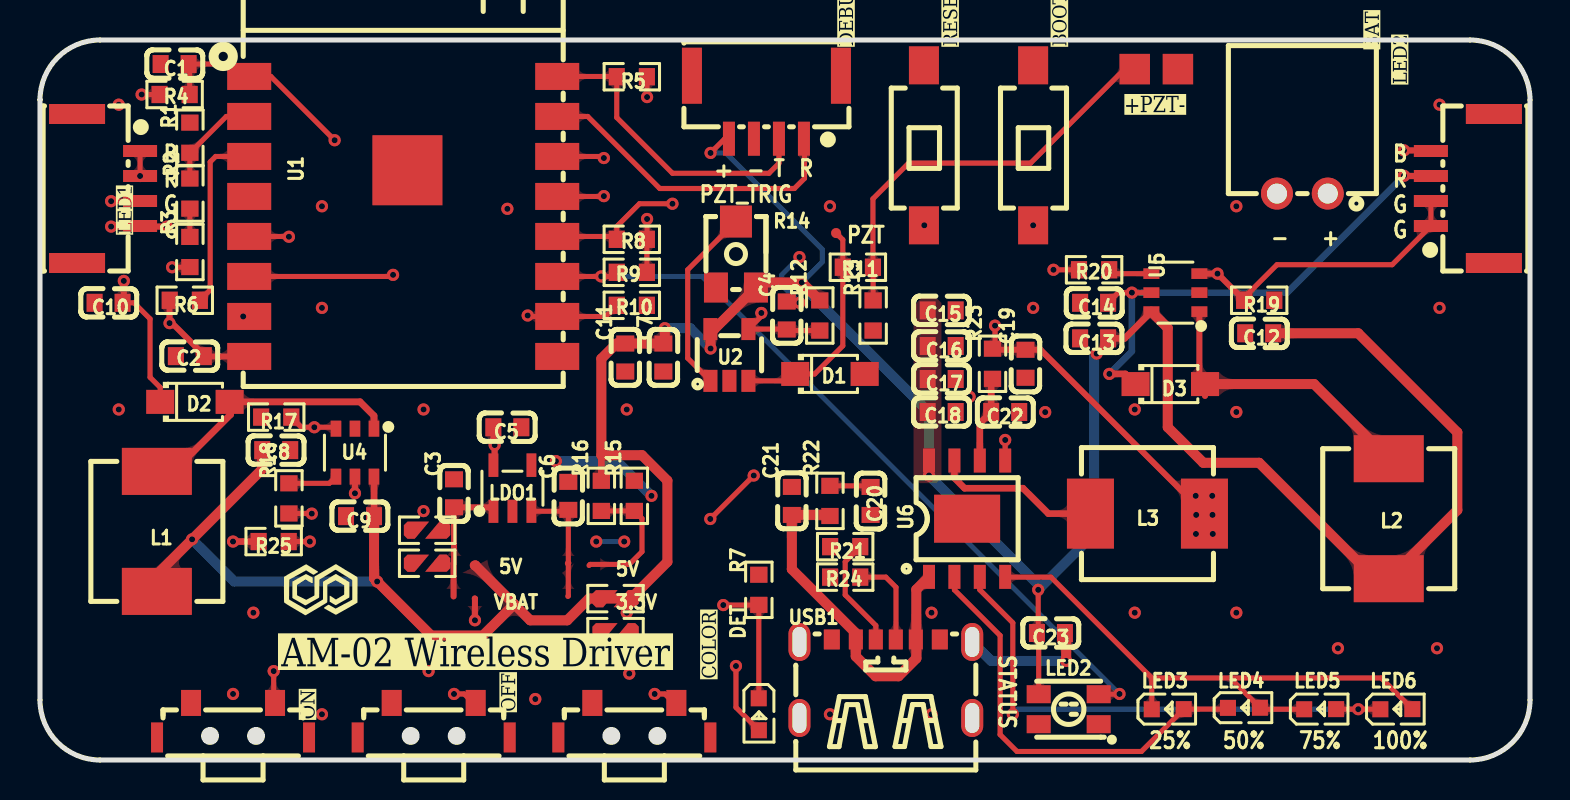
[diagram p2: board, top side]
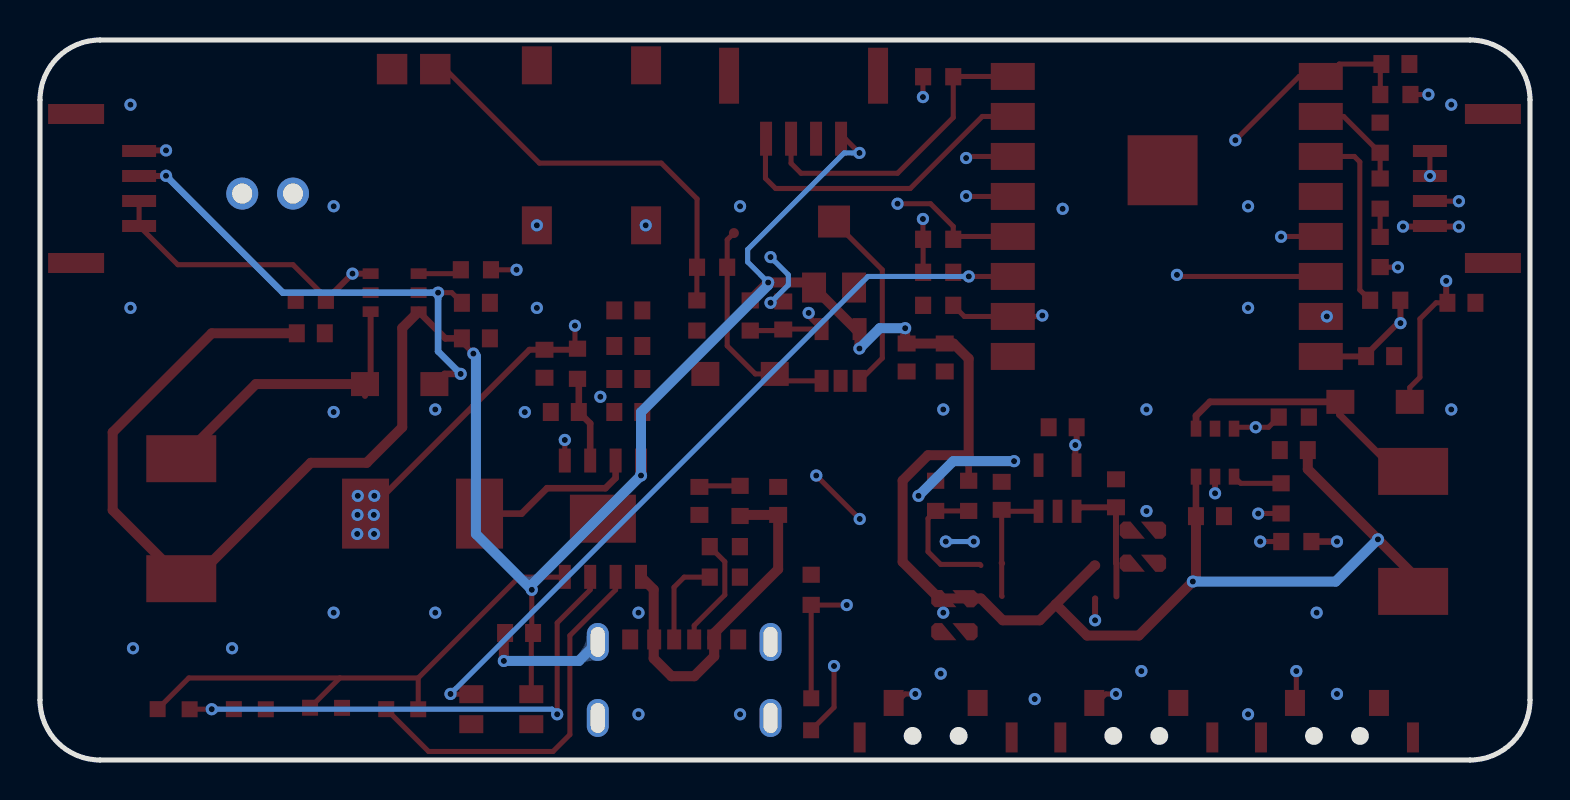
[diagram p3: board, bottom side, seen from below]

Outline 74.5 x 36 mm; copper layers: Top Layer, Inner1, Inner2, Bottom Layer. Coordinates in mm from the lower left corner of the outline.
Outline path: 0,33.01 0,3 arc(0.88,0.88) 3,0 71.5,0 arc(73.62,0.88) 74.5,3 74.5,33 arc(73.62,35.12) 71.5,36 3,36 arc(0.88,35.12) 0,33 0,33.01
Stack: Top Layer 0.035mm 外层铜厚1oz / Dielectric1 0.2104mm 7628 RC49% 8.6mil / Inner1 0.0152mm 内层铜厚 / Dielectric2 1.065mm 1.1mm H/HOZ 含铜 / Inner2 0.0152mm 内层铜厚 / Dielectric3 0.2104mm 7628 RC49% 8.6mil / Bottom Layer 0.035mm 外层铜厚1oz

## Design rules (mm)
template: 自定义配置
spacing copperThickness1oz (default): track to track 0.102, other pairs 0.152 to 0.3
spacing copperThickness2oz: track to track 0.203, other pairs 0.152 to 0.3
track width copperThickness1oz (default): min 0.127, default 0.254, max 2.54
track width copperThickness2oz: min 0.203, default 0.254, max 2.54
differential pair differentialPair (default): width min 0.127, default 0.254, max 2.54; gap min 0.152, default 0.152
via viaSize (default): diameter min 0.5, default 0.61, max 10; hole min 0.3, default 0.305, max 6.3
net VCC uses Power
net GND uses Power

## Placement (name value [footprint] x y rotation side)
3.3V  -  [cs]  26.92 8.13 180 top
5V  -  [cs]  21.21 9.78 0 top
5V#2  -  [cs]  26.92 9.78 180 top
BAT  XH-2AW  [CONN-TH_XH-2AW_C2908611]  63.12 28.32 180 top
BOOT  TS-1101-C-W  [SW-SMD_L6.0-W3.3-LS8.0]  49.66 30.73 90 top
C1  1uF  [C0603]  6.73 34.8 180 top
C2  1uF  [C0603]  7.49 20.19 0 top
C3  1uF  [C0603]  20.7 13.33 90 top
C4  100nF  [C0603]  37.34 22.22 270 top
C5  1uF  [C0603]  23.37 16.64 0 top
C6  1uF  [C0603]  26.42 13.21 90 top
C7  10uF  [C0603]  31.17 20.12 270 top
C8  10uF  [C0603]  11.81 15.49 0 top
C9  100nF  [C0603]  16 12.19 0 top
C10  470nF  [C0603]  3.43 22.86 180 top
C11  100nF  [C0603]  29.26 20.12 270 top
C12  10uF  [C0603]  60.96 21.34 180 top
C13  100nF  [C0603]  52.71 21.08 0 top
C14  470nF  [C0603]  52.71 22.86 180 top
C15  22uF  [C0603]  45.09 22.48 0 top
C16  22uF  [C0603]  45.09 20.7 0 top
C17  22uF  [C0603]  45.09 19.05 0 top
C18  22uF  [C0603]  45.09 17.4 0 top
C19  22uF  [C0603]  49.28 19.81 90 top
C20  1uF  [C0603]  41.53 12.95 90 top
C21  1uF  [C0603]  37.59 12.95 270 top
C22  22uF  [C0603]  48.26 17.4 180 top
C23  100nF  [C0603]  50.55 6.35 0 top
COLOR  TS-KG012EV  [SW-SMD_TS-KG012EV]  29.72 1.78 0 top
D1  1N4007  [SOD-123FL_L2.7-W1.8-LS3.8-RD]  39.5 19.3 0 top
D2  1N4007  [SOD-123FL_L2.7-W1.8-LS3.8-RD]  7.75 17.91 0 top
D3  1N4007  [SOD-123FL_L2.7-W1.8-LS3.8-RD]  56.51 18.8 0 top
DEBUG  WAFER-GH1.25-4PWB  [CONN-SMD_4P-P1.25_XUNPU_WAFER-GH1.25-4PWB]  36.32 32.64 180 top
DET  NCD0603R1  [LED0603-RD_RED]  35.94 2.29 270 top
L1  10uH  [IND-SMD_L7.3-W6.8]  5.84 11.43 90 top
L2  10uH  [IND-SMD_L7.3-W6.8]  67.44 12.06 90 top
L3  1uH  [IND-SMD_L7.2-W6.6_GPSR0730]  55.37 12.32 0 top
LDO1  ME6211C33M5G-N  [SOT-23-5_L3.0-W1.7-P0.95-LS2.8-BL]  23.62 13.59 0 top
LED1  NCD0603R1  [CONN-SMD_4P-P1.25_XUNPU_WAFER-GH1.25-4PWB]  3.43 28.58 270 top
LED2  XL-3528RGBW-WS2812B  [LED-SMD_4P-L3.5-W2.8-BR-1]  51.44 2.54 0 top
LED2#2  -  [CONN-SMD_4P-P1.25_XUNPU_WAFER-GH1.25-4PWB]  71.12 28.58 90 top
LED3  NCD0603W1  [LED0603-RD]  56.39 2.54 0 top
LED4  NCD0603W1  [LED0603-RD]  60.2 2.61 0 top
LED5  NCD0603W1  [LED0603-RD]  64.01 2.54 0 top
LED6  NCD0603W1  [LED0603-RD]  67.82 2.54 0 top
NOREF  -  [Pad_e2]  56.9 34.54 0 top
NOREF#2  -  [Pad_e0]  54.74 34.54 0 top
OFF  TS-KG012EV  [SW-SMD_TS-KG012EV]  19.69 1.78 0 top
ON  TS-KG012EV  [SW-SMD_TS-KG012EV]  9.65 1.78 0 top
R1  100kΩ  [R0603]  7.49 31.11 270 top
R2  200kΩ  [R0603]  7.49 28.32 270 top
R3  120kΩ  [R0603]  7.49 25.4 270 top
R4  10kΩ  [R0603]  6.73 33.27 0 top
R5  10kΩ  [R0603]  29.59 34.16 0 top
R6  10kΩ  [R0603]  7.24 22.99 0 top
R7  150Ω  [R0603]  35.94 8.51 90 top
R8  10kΩ  [R0603]  29.59 26.03 0 top
R9  10kΩ  [R0603]  29.59 24.38 0 top
R10  10kΩ  [R0603]  29.59 22.73 180 top
R11  10kΩ  [R0603]  40.89 24.64 0 top
R12  10kΩ  [R0603]  38.99 22.22 270 top
R13  1M  [R0603]  41.66 22.22 90 top
R14  50kΩ  [RES-ADJ-SMD_VG039NCH]  34.8 25.27 270 top
R15  120kΩ  [R0603]  29.72 13.21 270 top
R16  360kΩ  [R0603]  28.07 13.21 270 top
R17  5.1Ω  [R0603]  11.81 17.14 0 top
R18  1kΩ  [R0603]  12.45 13.08 90 top
R19  5.1Ω  [R0603]  60.96 22.99 180 top
R20  1kΩ  [R0603]  52.71 24.51 0 top
R21  5.1kΩ  [R0603]  40.26 10.67 0 top
R22  2Ω  [R0603]  39.5 12.95 270 top
R23  500mΩ  [R0603]  47.62 19.81 270 top
R24  5.1kΩ  [R0603]  40.26 9.14 0 top
R25  20Ω  [R0603]  11.68 10.92 180 top
RESET  TS-1101-C-W  [SW-SMD_L6.0-W3.3-LS8.0]  44.2 30.73 90 top
TP1  -  [Test-Point-0.5mm]  39.8 26.35 270 top
U1  WT8266-S6 ESP-12S  [WIFIM-SMD_16P-L24.0-W16.0-P2.00]  18.16 27.18 90 top
U2  RS331XF  [TSOT-23-5_L2.9-W1.6-P0.95-LS2.8-BR]  34.47 20.25 270 top
U4  SGM3732YTN6G/TR  [TSOT-23-6_L2.9-W1.6-P0.95-LS2.8-BR]  15.75 15.37 90 top
U5  SGM3732YTN6G/TR  [TSOT-23-6_L2.9-W1.6-P0.95-LS2.8-BR]  56.77 23.37 0 top
U6  IP5306  [ESOP-8_L4.9-W3.9-P1.27-LS6.0-BL-EP]  46.35 12.06 0 top
USB1  TYPE-C 6P(073)  [TYPE-C-SMD_TYPE-C-6P]  42.29 4.06 0 top
VBAT  -  [cs]  21.21 8.13 0 top

## Footprints (pads in the part's own frame, mm; a bottom-side part is the same pattern mirrored in y, then rotated)
C0603
  rect 0.8x0.9 smd: 1(-0.7,0) 2(0.7,0)
CONN-SMD_4P-P1.25_XUNPU_WAFER-GH1.25-4PWB
  rect 0.6x1.7 smd: 1(-1.875,1.575) 2(-0.625,1.575) 3(0.625,1.575) 4(1.875,1.575)
  rect 1x2.8 smd: 5(3.725,-1.575) 6(-3.725,-1.575)
CONN-TH_XH-2AW_C2908611
  round 1.6 hole 1: 1(-1.27,0) 2(1.27,0)
cs
  custom 1.26x0.86 smd: 1(7.04,-1.66) 2(8.1,-1.764)
ESOP-8_L4.9-W3.9-P1.27-LS6.0-BL-EP
  rect 0.6x1.2 smd: 1(-1.905,-2.909) 2(-0.635,-2.909) 3(0.635,-2.909) 4(1.905,-2.909) 5(1.905,2.909) 6(0.635,2.909) 7(-0.635,2.909) 8(-1.905,2.909)
  rect 3.3x2.4 smd: 9(0,0)
IND-SMD_L7.2-W6.6_GPSR0730
  rect 2.35x3.5 smd: 1(-2.85,0) 2(2.85,0)
IND-SMD_L7.3-W6.8
  rect 2.35x3.5 smd: 1(-3,0) 2(3,0)
LED0603-RD
  rect 0.8x0.8 smd: 1(-0.799,-0.004) 2(0.799,0.004)
LED0603-RD_RED
  rect 0.8x0.8 smd: 1(-0.799,-0.004) 2(0.799,0.004)
LED-SMD_4P-L3.5-W2.8-BR-1
  rect 1.2x0.9 smd: 1(1.5,-0.75) 2(1.5,0.75) 3(-1.5,0.75) 4(-1.5,-0.75)
Pad_e0
  rect 1.524x1.524 smd: 18(0,0)
Pad_e2
  rect 1.524x1.524 smd: 19(0,0)
R0603
  rect 0.806x0.864 smd: 1(-0.753,0) 2(0.753,0)
RES-ADJ-SMD_VG039NCH
  rect 1.5x1.2 smd: 1(1.65,-1) 3(1.65,1)
  rect 1.6x1.6 smd: 2(-1.65,0)
SOD-123FL_L2.7-W1.8-LS3.8-RD
  rect 1.4x1.2 smd: 1(-1.735,0) 2(1.735,0)
SOT-23-5_L3.0-W1.7-P0.95-LS2.8-BL
  rect 0.49x1.157 smd: 1(-0.95,-1.153) 2(0,-1.153) 3(0.95,-1.153)
  rect 0.49x1.175 smd: 4(0.95,1.153) 5(-0.95,1.153)
SW-SMD_L6.0-W3.3-LS8.0
  rect 1.9x1.5 smd: 1(-4,0) 2(4,0)
SW-SMD_TS-KG012EV
  rect 1x1.3 smd: 1(2.1,1.075) 2(-2.1,1.075)
  rect 0.6x1.5 smd: 3(-3.8,-0.65) 4(3.8,-0.65)
Test-Point-0.5mm
  round 0.5 smd: 1(0,0)
TSOT-23-5_L2.9-W1.6-P0.95-LS2.8-BR
  rect 1.1x0.7 smd: 1(1.294,-0.951) 2(1.294,-0.001) 3(1.294,0.951) 4(-1.294,0.951) 5(-1.294,-0.949)
TSOT-23-6_L2.9-W1.6-P0.95-LS2.8-BR
  rect 0.8x0.532 smd: 1(1.2,-0.95) 2(1.2,0) 3(1.2,0.95) 4(-1.2,0.95) 5(-1.2,0) 6(-1.2,-0.95)
TYPE-C-SMD_TYPE-C-6P
  oval 1.1x1.9 hole 0.7x1.5: 7(-4.32,1.837) 7(-4.32,-1.962) 7(4.32,1.837) 7(4.32,-1.962)
  rect 0.7x1 smd: A5(-0.5,1.962) A9(1.5,1.962) B5(0.5,1.962) B9(-1.5,1.962)
  rect 0.8x1 smd: A12(2.7,1.962) B12(-2.7,1.962)
WIFIM-SMD_16P-L24.0-W16.0-P2.00
  rect 1.35x2.2 smd: 1(7,7.7) 2(5,7.7) 3(3,7.7) 4(1,7.7) 5(-1,7.7) 6(-3,7.7) 7(-5,7.7) 8(-7,7.7) 9(-7,-7.7) 10(-5,-7.7) 11(-3,-7.7) 12(-1,-7.7) 13(1,-7.7) 14(3,-7.7) 15(5,-7.7) 16(7,-7.7)
  rect 3.5x3.5 smd: 17(2.31,-0.21)

## Nets
+5V: 3.3V.1 5V.2 C7.1 C8.1 C9.2 C11.1 C12.1 C13.2 C15.1 C16.1 C17.1 C18.1 C23.1 DEBUG.4 L1.1 L2.1 LED2.3 R12.1 R14.3 R16.1 U2.5 U4.6 U5.6 U6.8
GND: BAT.2 BOOT.2 C1.2 C2.1 C3.2 C4.1 C5.2 C6.2 C7.2 C8.2 C9.1 C10.2 C11.2 C12.2 C13.1 C14.2 C15.2 C16.2 C17.2 C18.2 C19.1 C20.1 C21.1 C22.1 C23.2 COLOR.2 COLOR.3 COLOR.4 D1.2 DEBUG.3 DEBUG.5 DEBUG.6 LDO1.2 LED1.5 LED1.6 LED2.1 LED2#2.5 LED2#2.6 NOREF.19 OFF.2 OFF.3 OFF.4 ON.2 ON.3 ON.4 R1.1 R7.2 R10.1 R13.1 R14.1 R15.1 R17.1 R19.1 R21.1 R24.1 RESET.2 U1.9 U1.17 U2.2 U4.2 U5.2 U6.9 USB1.7 USB1.A12 USB1.B12
VBAT: BAT.1 C19.2 L3.2 R3.2 R23.1 VBAT.2
VBUS: C21.2 R22.2 U6.1 USB1.A9 USB1.B9
VCC: C2.2 C5.1 LDO1.5 R4.1 R5.2 R6.1 R8.2 R9.2 U1.8
ADC: R1.2 R2.1 U1.2
BOOT: BOOT.1 R8.1 U1.12
BTN_COLOR: COLOR.1 U1.6
BTN_PWR_OFF: OFF.1 U1.5
BTN_PWR_ON: ON.1 R25.2 U1.7
DET: DET.1 R7.1 U1.13
EN: R6.2 U1.3
LED0: LED2.2 R9.1 U1.11
LED1: LED3.2 LED4.1 U6.2
LED2: LED5.2 LED6.1 U6.3
LED3: LED3.1 LED4.2 LED5.1 LED6.2 U6.4
LED_DRV_B: C10.1 D2.1 LED1.4 LED2#2.4 U4.5
LED_DRV_R: C14.1 D3.1 LED1.3 LED2#2.3 U5.5
LED_GND: LED1.1 LED1.2 LED2#2.1 LED2#2.2 R17.2 R19.2 U4.3 U5.3
LEDB: R10.2 R18.1 U1.10
LEDR: R20.1 U1.14
PZT+: NOREF#2.18 R11.2 R13.2
RST: C1.1 R4.2 RESET.1 U1.1
RX: DEBUG.1 U1.15
TX: DEBUG.2 R5.1 U1.16
$1N2901: R21.2 USB1.A5
$1N2902: R24.2 USB1.B5
$1N3120: C20.2 R22.1
$1N3822: R25.1 U6.5
$1N4370: C22.2 R23.2 U6.6
$1N4629: L3.1 U6.7
$1N6430: D2.2 L1.2 U4.1
$1N8583: D3.2 L2.2 U5.1
$1N9022: 5V.1 C3.1 LDO1.1 VBAT.1
$1N10986: R2.2 R3.1
$1N13736: R14.2 U2.1
$1N13750: D1.1 R11.1 TP1.1 U2.3
$1N14015: C4.2 DET.2 R12.2 U2.4
$1N14215: 3.3V.2 5V#2.2 C6.1 LDO1.3
$1N14263: 5V#2.1 R15.2 R16.2
$1N19690: R18.2 U4.4
$1N19718: R20.2 U5.4

Pads without a net: LDO1 4; LED2 4; U1 4

## Via types
v1: diameter 0.61, hole 0.305, Top Layer to Bottom Layer, 71 vias
v2: diameter 0.61, hole 0.304, Top Layer to Bottom Layer, 29 vias

## Routing (per net, layer and track width the routed paths; a pad name or vN(x,y) marks a point on that pad's centre or on a via; arc(x,y) is an arc through that point)
+5V: length 167.4
  Top Layer w0.254: DEBUG.4 34.24,31.06 v1(33.53,30.35) ; C13.2 53.41,20.89 v1(52.83,20.32) ; LED2.3 49.94,6.26 C23.1 49.91,6.42 v1(49.91,8.51)
  Top Layer w0.33: C9.2 16.7,14.16 U4.6 ; C13.2 54.23,21.08 55.57,22.42 ; 28.07,15.24 R16.1
  Top Layer w0.5: 23.71,7.79 24.51,6.98 26.36,6.98 27.45,8.08 29.54,8.08 31.37,9.91 31.37,13.97 30.1,15.24 28.07,15.24 28.07,20.07 28.83,20.82 C11.1 C7.1 31.24,20.9 v1(31.24,21.59) ; 23.71,7.79 22.15,6.22 19.56,6.22 16.7,9.08 C9.2 ; 23.71,7.79 21.77,9.73 21.74,9.73 ; v1(33.53,20.57) 33.53,21.54 33.52,21.55 33.72,21.55 36.05,23.88 v1(38.09,23.88) R12.1 ; L1.1 5.84,9.27 v1(7.6,11.03) 11.11,14.54 C8.1 ; 55.57,22.42 56.39,21.6 56.39,16.64 58.17,14.86 60.96,14.86 66.75,9.06 L2.1 70.87,12.49 70.87,16.38 65.91,21.34 C12.1
  Bottom Layer w0.254: v1(38.09,23.88) 39.12,24.9 39.12,25.53 34.29,30.35 v1(33.53,30.35)
  Bottom Layer w0.5: v1(33.53,20.57) 32.51,21.59 v1(31.24,21.59) ; v1(7.6,11.03) 9.71,8.92 v1(16.86,8.92) ; v1(52.83,20.32) 52.71,20.19 52.71,11.3 v1(49.91,8.51) 49.91,8.76 v1(44.45,14.22) 44.45,17.38 38.09,23.74 v1(38.09,23.88)
GND: length 15
  Top Layer w0.5: v1(51.31,4.95) 51.31,6.29 C23.2
  Bottom Layer w0.254: v1(37.97,22.86) 37.08,23.75 37.08,24.26 v1(37.97,25.15)
  Bottom Layer w0.5: v1(25.8,14.94) 28.84,14.94 v1(30.57,13.21) ; USB1.7 47.56,4.95 v1(51.31,4.95)
  vias: v1(46.48,18.16) v1(50.26,17.39) v2(3.94,32.77) v2(3.94,17.53) v2(9.65,3.3) v2(10.67,7.37) v2(14.1,27.69) v2(14.1,22.61) v2(14.1,2.29) v2(19.18,17.53) v2(19.18,12.45) v2(19.43,4.44) v2(23.37,27.56) v2(24.76,3.05) v2(29.34,17.53) v2(29.34,7.37) v2(29.46,4.32) v2(39.5,27.69) v2(39.5,2.29) v2(44.58,7.37) v2(44.58,2.29) v2(49.66,22.61) v2(54.74,17.53) v2(54.74,7.37) v2(59.82,27.69) v2(59.82,17.4) v2(59.82,7.37) v2(64.9,5.59) v2(69.85,5.59) v2(69.98,32.77) v2(69.98,22.61)
VBAT: length 74
  Top Layer w0.254: v1(47.75,21.72) 47.75,20.69 R23.1 ; v1(6.6,24.64) 7.48,24.64 R3.2
  Top Layer w0.3: L3.2 50.03,20.51 C19.2 47.68,20.51 R23.1 ; v1(21.75,6.98) 21.75,8.07 21.74,8.08
  Inner2 w0.508: v1(47.75,21.72) 47.37,22.1 37.59,22.1 22.48,6.98 v1(21.75,6.98) 20.96,6.98 12.32,15.62 12.32,18.92 v1(6.6,24.64)
  vias: v1(57.78,13.21) v1(57.81,12.26) v1(57.8,11.3) v1(58.61,13.21) v1(58.63,12.26) v1(58.64,11.3)
VBUS: length 18.5
  Top Layer w0.5: USB1.A9 43.81,6.05 43.81,8.52 U6.1 ; R22.2 39.44,12.25 C21.2 37.59,9.54 40.77,6.36 40.77,6.23 40.89,6.1
  Top Layer w0.508: USB1.B9 40.79,5.18 41.78,4.19 42.93,4.19 43.81,5.08 43.81,6 USB1.A9
VCC: length 12.1
  Top Layer w0.254: 8.27,20.18 8.19,20.25 C2.2 ; v1(5.08,33.27) R4.1 ; v1(30.35,27.05) 30.35,26.04 R8.2 R9.2 ; v1(30.35,33.15) 30.35,34.15 R5.2
  Top Layer w0.3: 8.27,20.18 10.16,20.18 ; LDO1.5 22.73,14.8 v1(22.73,15.75) 22.67,15.81 C5.1 ; R6.1 6.48,22.98 v1(6.48,21.84) 6.6,21.84 8.19,20.25
ADC: length 4.7
  Top Layer w0.254: R2.1 R1.2 7.5,30.36 9.32,32.18 10.16,32.18
BOOT: length 25.7
  Top Layer w0.254: v1(31.62,27.81) 29.97,27.81 28.84,26.68 R8.1 28.69,26.18 26.16,26.18
  Inner1 w0.254: v1(31.62,27.81) 33.4,26.03 48.96,26.03 v1(49.66,26.73)
BTN_COLOR: length 36.4
  Top Layer w0.254: v1(30.73,3.3) 31.24,3.3 31.82,2.73 ; 10.16,24.18 17.57,24.18 v1(17.65,24.26)
  Inner1 w0.254: v1(17.65,24.26) 28.5,13.42 28.5,3.59 28.78,3.3 v1(30.73,3.3)
BTN_PWR_OFF: length 35.1
  Top Layer w0.254: v1(12.45,26.16) 12.43,26.18 10.16,26.18 ; 21.78,2.73 21.21,3.3 v1(20.7,3.3)
  Inner1 w0.254: v1(20.7,3.3) 14.99,3.3 14.48,3.81 14.48,8.64 12.7,10.41 12.7,12.95 14.99,15.24 14.99,23.62 v1(12.45,26.16)
BTN_PWR_ON: length 22.3
  Top Layer w0.254: v1(11.68,4.44) 11.68,3.3 11.75,3.23
  Top Layer w0.33: v1(9.65,10.92) R25.2
  Inner1 w0.254: v1(11.68,4.44) 10.02,4.44 9.65,4.81 v1(9.65,10.92) 9.65,21.72 10.16,22.22
  vias: v1(10.16,22.18)
DET: length 31.4
  Top Layer w0.254: v1(28.19,28.19) 28.18,28.18 26.16,28.18 ; v1(34.16,7.75) 35.93,7.75 R7.1 35.94,3.09 DET.1
  Inner1 w0.254: v1(34.16,7.75) 34.16,22.22 v1(28.19,28.19)
EN: length 8.9
  Top Layer w0.254: R6.2 8.51,23.5 8.51,29.9 8.78,30.18 10.16,30.18
LED0: length 38.4
  Top Layer w0.254: 26.16,24.18 v1(28.06,24.18) 28.63,24.18 R9.1 ; LED2.2 53.96,3.29 v1(53.97,3.3)
  Bottom Layer w0.254: v1(53.97,3.3) 33.1,24.18 v1(28.06,24.18)
LED1: length 21.5
  Top Layer w0.254: LED4.1 59.34,2.54 LED3.2 55.07,0.43 48.85,0.43 48.01,1.27 48.01,6.22 45.72,8.51 U6.2
LED2: length 27.1
  Top Layer w0.254: U6.3 46.99,8.51 48.64,6.86 v1(48.64,2.29) ; LED6.1 67.01,2.54 v1(65.91,2.54) 64.81,2.54 LED5.2
  Bottom Layer w0.254: v1(48.64,2.29) 48.9,2.54 v1(65.91,2.54)
LED3: length 29
  Top Layer w0.254: 59.51,4.1 67.06,4.1 LED6.2 ; 59.51,4.1 LED4.2 61.07,2.54 LED5.1 ; 59.51,4.1 55.59,4.1 ; LED3.1 55.59,4.1 ; 55.59,4.1 50.55,9.14 48.27,9.14 U6.4
LED_DRV_B: length 108.3
  Top Layer w0.254: C10.1 4.7,22.86 5.5,22.06 5.5,19.13 6.01,18.63 D2.1 ; 4.97,26.67 LED1.4
  Top Layer w0.3: C10.1 4.19,22.92 v1(4.19,23.95) ; v1(15.75,13.33) U4.5 ; 69.54,30.45 69.51,30.48 v1(68.2,30.48) ; v1(3.56,26.67) 4.97,26.67 ; 5,26.67 v1(6.35,26.67)
  Inner1 w0.7: v1(68.2,30.48) 64.13,34.54 4.44,34.54 2.03,32.13 2.03,28.19 v1(3.56,26.67)
  Inner2 w0.3: v1(6.35,26.67) 4.19,24.51 v1(4.19,23.95)
  Inner2 w0.6: v1(15.75,13.33) 15.75,17.91 6.98,26.67 v1(6.35,26.67)
LED_DRV_R: length 95.7
  Top Layer w0.254: C14.1 53.91,23.37 v1(54.59,23.37) 55.57,23.37 ; LED1.3 4.99,27.94 v1(3.56,27.94)
  Top Layer w0.3: 69.54,29.2 68.21,29.2 v1(68.2,29.21)
  Top Layer w0.33: D3.1 54.27,19.3 v1(53.47,19.3)
  Inner1 w0.7: v1(68.2,29.21) 66.68,29.21 63.75,32.13 6.22,32.13 3.56,29.46 v1(3.56,27.94)
  Bottom Layer w0.33: v1(68.2,29.21) 62.36,23.37 v1(54.59,23.37) 54.59,20.43 v1(53.47,19.3)
LED_GND: length 91.3
  Top Layer w0.254: R17.2 13.07,16.64 v1(13.72,16.64) 14.73,16.64 U4.3 ; R19.2 60.21,23.12 61.85,24.77 67.61,24.77 69.54,26.7 69.54,27.95 ; v1(5,29.2) LED1.1
  Top Layer w0.3: U5.3 v1(58.88,24.32) R19.2
  Inner1 w0.254: 5.08,29.21 5.97,29.21 13.72,21.46 v1(13.72,16.64)
  Inner2 w0.6: v1(5,29.2) 53.99,29.2 v1(58.88,24.32)
LEDB: length 29.8
  Top Layer w0.254: R10.2 28.28,22.18 24.43,22.18 v1(24.38,22.22) ; R18.1 13.58,12.33 v1(13.59,12.32)
  Inner1 w0.254: v1(13.59,12.32) 16.38,15.11 16.38,25.15 17.27,26.03 20.57,26.03 v1(24.38,22.22)
LEDR: length 28
  Top Layer w0.254: v1(28.19,30.1) 28.12,30.18 26.29,30.18 ; R20.1 v1(50.67,24.51)
  Inner1 w0.254: v1(28.19,30.1) 33.78,24.51 v1(50.67,24.51)
PZT+: length 20.9
  Top Layer w0.254: NOREF#2.18 54.23,34.54 49.53,29.84 43.43,29.84 41.65,28.06 R11.2 41.66,24.63 R13.2
RST: length 41.7
  Top Layer w0.254: v1(14.73,30.99) 11.54,34.18 10.16,34.18 9.54,34.8 C1.1 7.48,34.74 R4.2
  Inner1 w0.254: v1(44.21,26.73) 39.96,30.99 v1(14.73,30.99)
RX: length 15.8
  Top Layer w0.254: DEBUG.1 38.23,31.03 38.23,29.08 37.72,28.58 30.99,28.58 27.38,32.18 26.16,32.18
TX: length 15.4
  Top Layer w0.254: 26.16,34.18 28.82,34.18 R5.1 28.84,32.12 31.62,29.34 36.45,29.34 36.95,29.83 DEBUG.2
$1N2901: length 5.6
  Top Layer w0.254: R21.2 40.26,9.91 40.26,8.25 41.79,6.72 USB1.A5
$1N2902: length 4.6
  Top Layer w0.254: R24.2 42.29,9.14 42.8,8.64 42.8,6.03 USB1.B5
$1N3120: length 2.1
  Top Layer w0.254: C20.2 41.48,13.71 R22.1
$1N3822: length 39.4
  Top Layer w0.254: v1(35.69,14.22) v1(33.51,12.05) ; U6.5 v1(48.26,16) ; R25.1 v1(13.49,10.92)
  Inner1 w0.254: v1(27.81,10.92) v1(13.49,10.92) ; v1(33.51,12.05) 32.38,10.92 v1(29.21,10.92) ; v1(48.26,16) 47.75,16.51 37.97,16.51 v1(35.69,14.22)
  Bottom Layer w0.254: v1(27.81,10.92) v1(29.21,10.92)
$1N4370: length 4.3
  Top Layer w0.33: U6.6 46.99,16.83 C22.2 47.56,18.99 R23.2
$1N4629: length 8.4
  Top Layer w0.33: U6.7 45.72,14.1 46.23,13.59 49.15,13.59 50.42,12.32 L3.1
$1N6430: length 13.6
  Top Layer w0.34: L1.2 6.68,14.43 9.53,17.27 9.53,17.91 16,17.91 16.7,17.21 U4.1
$1N8583: length 15.1
  Top Layer w0.3: 58.25,18.2 D3.2 57.97,19.08 U5.1
  Top Layer w0.5: L2.2 63.71,18.8 D3.2
$1N9022: length 6.5
  Top Layer w0.3: LDO1.1 22.47,12.64 20.7,12.64 20.7,9.85 20.68,9.83 20.68,8.18
$1N10986: length 1.4
  Top Layer w0.254: R2.2 R3.1
$1N13736: length 9.4
  Top Layer w0.254: U2.1 32.38,20.09 32.38,24.51 R14.2
$1N13750: length 11.2
  Top Layer w0.254: TP1.1 40.14,26.01 R11.1 40.14,20.71 38.74,19.3 D1.1 37.42,18.96 35.42,18.96
$1N14015: length 26.5
  Top Layer w0.254: v1(36.07,22.35) 36.07,22.19 35.42,21.55 37.32,21.55 C4.2 37.39,21.47 R12.2 ; DET.2 34.8,2.63 v1(34.8,4.7)
  Inner1 w0.254: v1(34.8,4.7) 34.8,15.62 36.07,16.89 v1(36.07,22.35)
$1N14215: length 6.2
  Top Layer w0.254: 26.39,8.18 26.42,8.2 C6.1 ; LDO1.3 26.34,12.44
  Top Layer w0.3: 26.34,12.44 C6.1 ; 26.42,9.85 26.39,9.83
$1N14263: length 6.8
  Top Layer w0.254: 27.45,9.73 27.51,9.78 29.46,9.78 30.1,10.41 30.1,12.07 R15.2 R16.2
$1N19690: length 2.5
  Top Layer w0.254: R18.2 14.47,13.83 U4.4
$1N19718: length 2.2
  Top Layer w0.254: R20.2 53.65,24.32 55.57,24.32

## Copper pours and planes (outline as drawn; the poured copper is in the pictures)
+5V on Top Layer: 43.68,23.1 45.08,23.1 45.08,13.84 43.68,13.84
GND on Top Layer: -1.27,37.72 76.33,37.72 76.33,-2.67 -1.27,-2.67
GND on Bottom Layer: -1.14,38.73 77.6,38.73 77.6,-2.79 -1.14,-2.79
VBAT on Inner2: 56.01,29.72 65.54,29.72 65.54,9.02 56.01,9.02
VCC on Inner2: -1.52,36.83 75.95,36.83 75.95,-0.76 -1.52,-0.76

Small or netless copper shapes (teardrops, artwork), in the pictures only: 236 on Top Layer, 19 on Bottom Layer, 28 on Inner1, 3 on Inner2

## Text on the board
Top Silkscreen Layer: 25% | 50% | 75% | 100% | STATUS | B | R | G | PZT_TRIG | PZT | - | + | T | +PZT- | AM-02 Wireless Driver

# Board PCB2
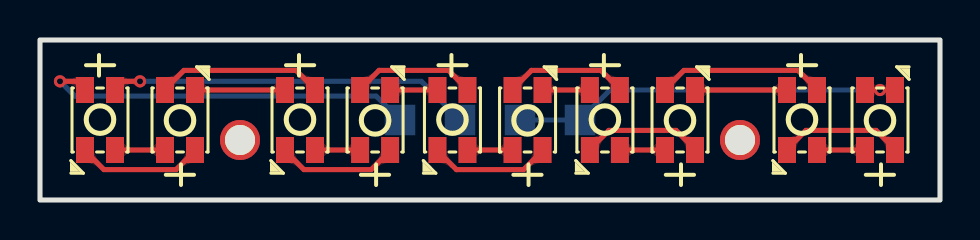
[diagram p4: board, top side]
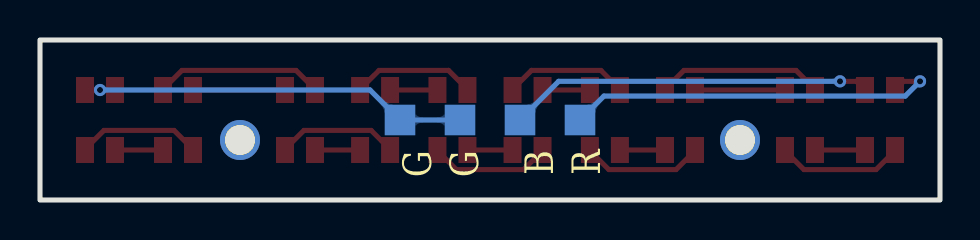
[diagram p5: board, bottom side, seen from below]

Outline 45 x 8 mm; copper layers: Top Layer, Bottom Layer. Coordinates in mm from the lower left corner of the outline.
Outline path: rectangle 0,8 45,0
Stack: Top Layer 0.035mm / Dielectric1 1.51mm FR4 er 4.5 / Bottom Layer 0.035mm

## Design rules (mm)
template: JLCPCB Capability(Two Layers Board)
spacing copperThickness1oz (default): track to track 0.102, other pairs 0.152 to 0.3
spacing copperThickness2oz: track to track 0.203, other pairs 0.152 to 0.3
track width copperThickness1oz (default): min 0.127, default 0.254, max 2.54
track width copperThickness2oz: min 0.203, default 0.254, max 2.54
differential pair differentialPair (default): width min 0.127, default 0.254, max 2.54; gap min 0.152, default 0.152
via viaSize (default): diameter min 0.5, default 0.61, max 10; hole min 0.3, default 0.305, max 6.3

## Placement (name value [footprint] x y rotation side)
LED1  XL-3528SURUBC  [LED-SMD_4P-L3.2-W2.8-LS3.5-TL]  3 4 90 top
LED2  XL-3528SURUBC  [LED-SMD_4P-L3.2-W2.8-LS3.5-TL]  7 4 270 top
LED3  XL-3528SURUBC  [LED-SMD_4P-L3.2-W2.8-LS3.5-TL]  13 4 90 top
LED4  XL-3528SURUBC  [LED-SMD_4P-L3.2-W2.8-LS3.5-TL]  16.75 4 270 top
LED5  XL-3528SURUBC  [LED-SMD_4P-L3.2-W2.8-LS3.5-TL]  20.62 4 90 top
LED6  XL-3528SURUBC  [LED-SMD_4P-L3.2-W2.8-LS3.5-TL]  24.38 4 270 top
LED7  XL-3528SURUBC  [LED-SMD_4P-L3.2-W2.8-LS3.5-TL]  28.25 4 90 top
LED8  XL-3528SURUBC  [LED-SMD_4P-L3.2-W2.8-LS3.5-TL]  32 4 270 top
LED9  XL-3528SURUBC  [LED-SMD_4P-L3.2-W2.8-LS3.5-TL]  38.1 4 90 top
LED10  XL-3528SURUBC  [LED-SMD_4P-L3.2-W2.8-LS3.5-TL]  42 4 270 top
NOREF  -  [Pad_e110]  27 4 0 top
NOREF#2  -  [Pad_e113]  24 4 0 top
NOREF#3  -  [Pad_e34]  35 3 0 top
NOREF#4  -  [Pad_e114]  21 4 0 top
NOREF#5  -  [Pad_e115]  18 4 0 top
NOREF#6  -  [Pad_e37]  10 3 0 top

## Footprints (pads in the part's own frame, mm; a bottom-side part is the same pattern mirrored in y, then rotated)
LED-SMD_4P-L3.2-W2.8-LS3.5-TL
  rect 1.3x0.9 smd: 1(-1.5,0.75) 2(1.5,0.75) 3(-1.5,-0.75) 4(1.5,-0.75)
Pad_e34
  round 2 hole 1.5: 5(0,0)
Pad_e37
  round 2 hole 1.5: 5(0,0)
Pad_e110
  rect 1.524x1.524 smd far side: 4(0,0)
Pad_e113
  rect 1.524x1.524 smd far side: 3(0,0)
Pad_e114
  rect 1.524x1.524 smd far side: 2(0,0)
Pad_e115
  rect 1.524x1.524 smd far side: 1(0,0)

## Nets
As in the schematic, except:
LED_DRV_B: LED1.4 NOREF#4.2
LED_DRV_R: LED1.2 NOREF#5.1
LED_GND: LED10.1 LED10.3 NOREF.4 NOREF#2.3

Pads without a net: NOREF#3 5; NOREF#6 5

## Via types
v1: diameter 0.61, hole 0.305, Top Layer to Bottom Layer, 3 vias

## Routing (per net, layer and track width the routed paths; a pad name or vN(x,y) marks a point on that pad's centre or on a via; arc(x,y) is an arc through that point)
LED_DRV_B: length 18.2
  Top Layer w0.254: v1(5,5.93) 4.18,5.93 LED1.4
  Bottom Layer w0.254: NOREF#4.2 19.07,5.93 v1(5,5.93)
LED_DRV_R: length 19.2
  Top Layer w0.254: LED1.2 1.82,5.93 v1(1,5.93)
  Bottom Layer w0.254: NOREF#5.1 16.8,5.2 1.74,5.2 v1(1,5.93)
LED_GND: length 20.1
  Top Layer w0.254: LED10.1 v1(42,5.5) LED10.3
  Bottom Layer w0.254: NOREF#2.3 NOREF.4 28.5,5.5 v1(42,5.5)
$1N497: length 4.5
  Top Layer w0.254: LED2.1 LED3.2
$1N498: length 2.4
  Top Layer w0.254: LED4.1 LED5.2
$1N499: length 6.1
  Top Layer w0.254: LED8.2 32.75,2.53 31.8,3.48 28.44,3.48 27.5,2.53 LED7.1
$1N500: length 6.3
  Top Layer w0.254: LED9.1 37.35,2.53 38.3,3.48 41.8,3.48 42.75,2.53 LED10.2
$1N505: length 2.5
  Top Layer w0.254: LED1.3 LED2.4
$1N506: length 8.4
  Top Layer w0.254: LED2.3 6.25,5.53 7.2,6.48 12.8,6.48 13.75,5.53 LED3.4
$1N507: length 6.2
  Top Layer w0.254: LED5.4 21.37,5.53 20.42,6.48 16.95,6.48 16,5.53 LED4.3
$1N508: length 2.3
  Top Layer w0.254: LED8.4 LED7.3
$1N509: length 2.4
  Top Layer w0.254: LED10.4 LED9.3
$1N510: length 6.1
  Top Layer w0.254: LED6.2 25.13,2.47 24.18,1.52 20.82,1.52 19.87,2.47 LED5.1
$1N511: length 8.5
  Top Layer w0.254: LED8.3 31.25,5.53 32.2,6.48 37.9,6.48 38.85,5.53 LED9.4
$1N512: length 2.3
  Top Layer w0.254: LED3.3 LED4.4
$1N513: length 4.6
  Top Layer w0.254: LED9.2 LED8.1
$1N514: length 6.1
  Top Layer w0.254: LED3.1 12.25,2.47 13.2,1.52 16.56,1.52 17.5,2.47 LED4.2
$1N515: length 2.3
  Top Layer w0.254: LED5.3 LED6.4
$1N516: length 2.4
  Top Layer w0.254: LED7.2 LED6.1
$1N517: length 6.2
  Top Layer w0.254: LED7.4 29,5.53 28.05,6.48 24.58,6.48 23.63,5.53 LED6.3
$1N518: length 6.4
  Top Layer w0.254: LED2.2 7.75,2.47 6.8,1.52 3.2,1.52 2.25,2.47 LED1.1

## Copper pours and planes (outline as drawn; the poured copper is in the pictures)
LED_GND on Top Layer: -1.52,12.19 46.61,12.19 46.61,-2.8 -1.52,-2.8

Small or netless copper shapes (teardrops, artwork), in the pictures only: 44 on Top Layer, 8 on Bottom Layer

## Text on the board
Bottom Silkscreen Layer: B / R | G / G
